# EAGLE design C3D Re-Mini (EAGLE 7.5.0)
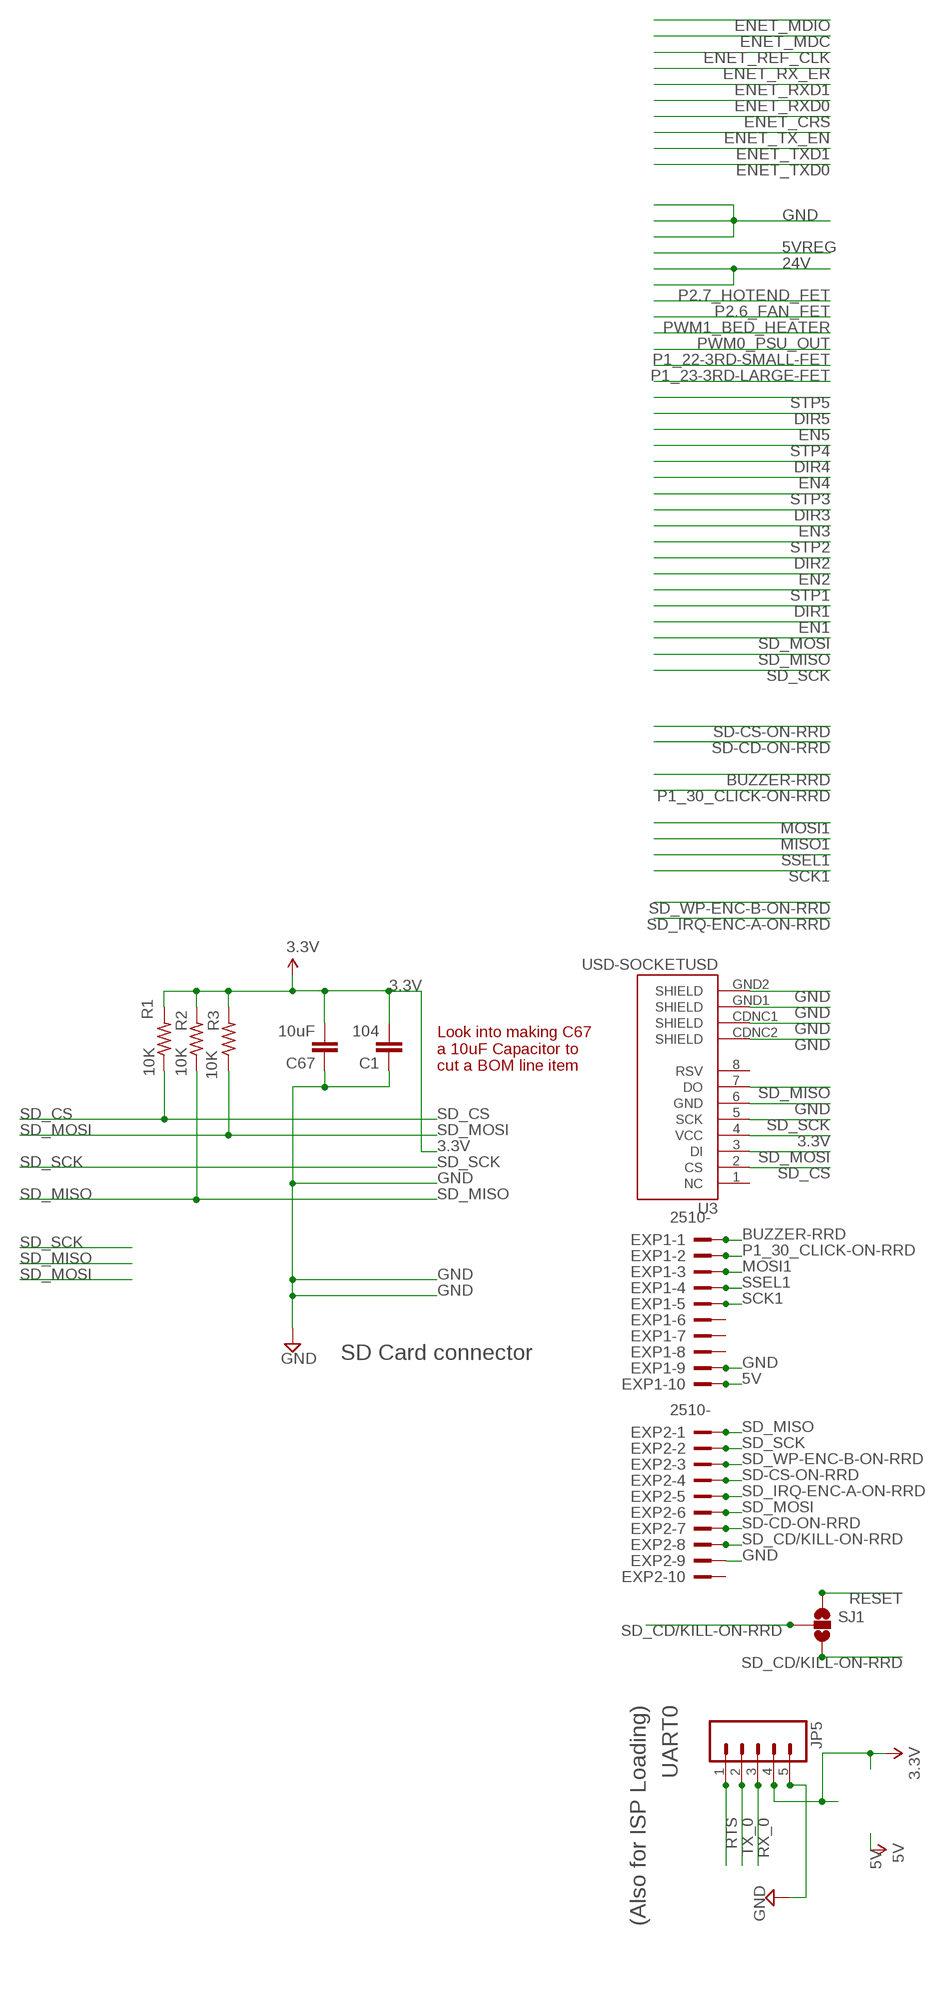
[diagram p0: schematic, sheet 1, part 1 of 3]
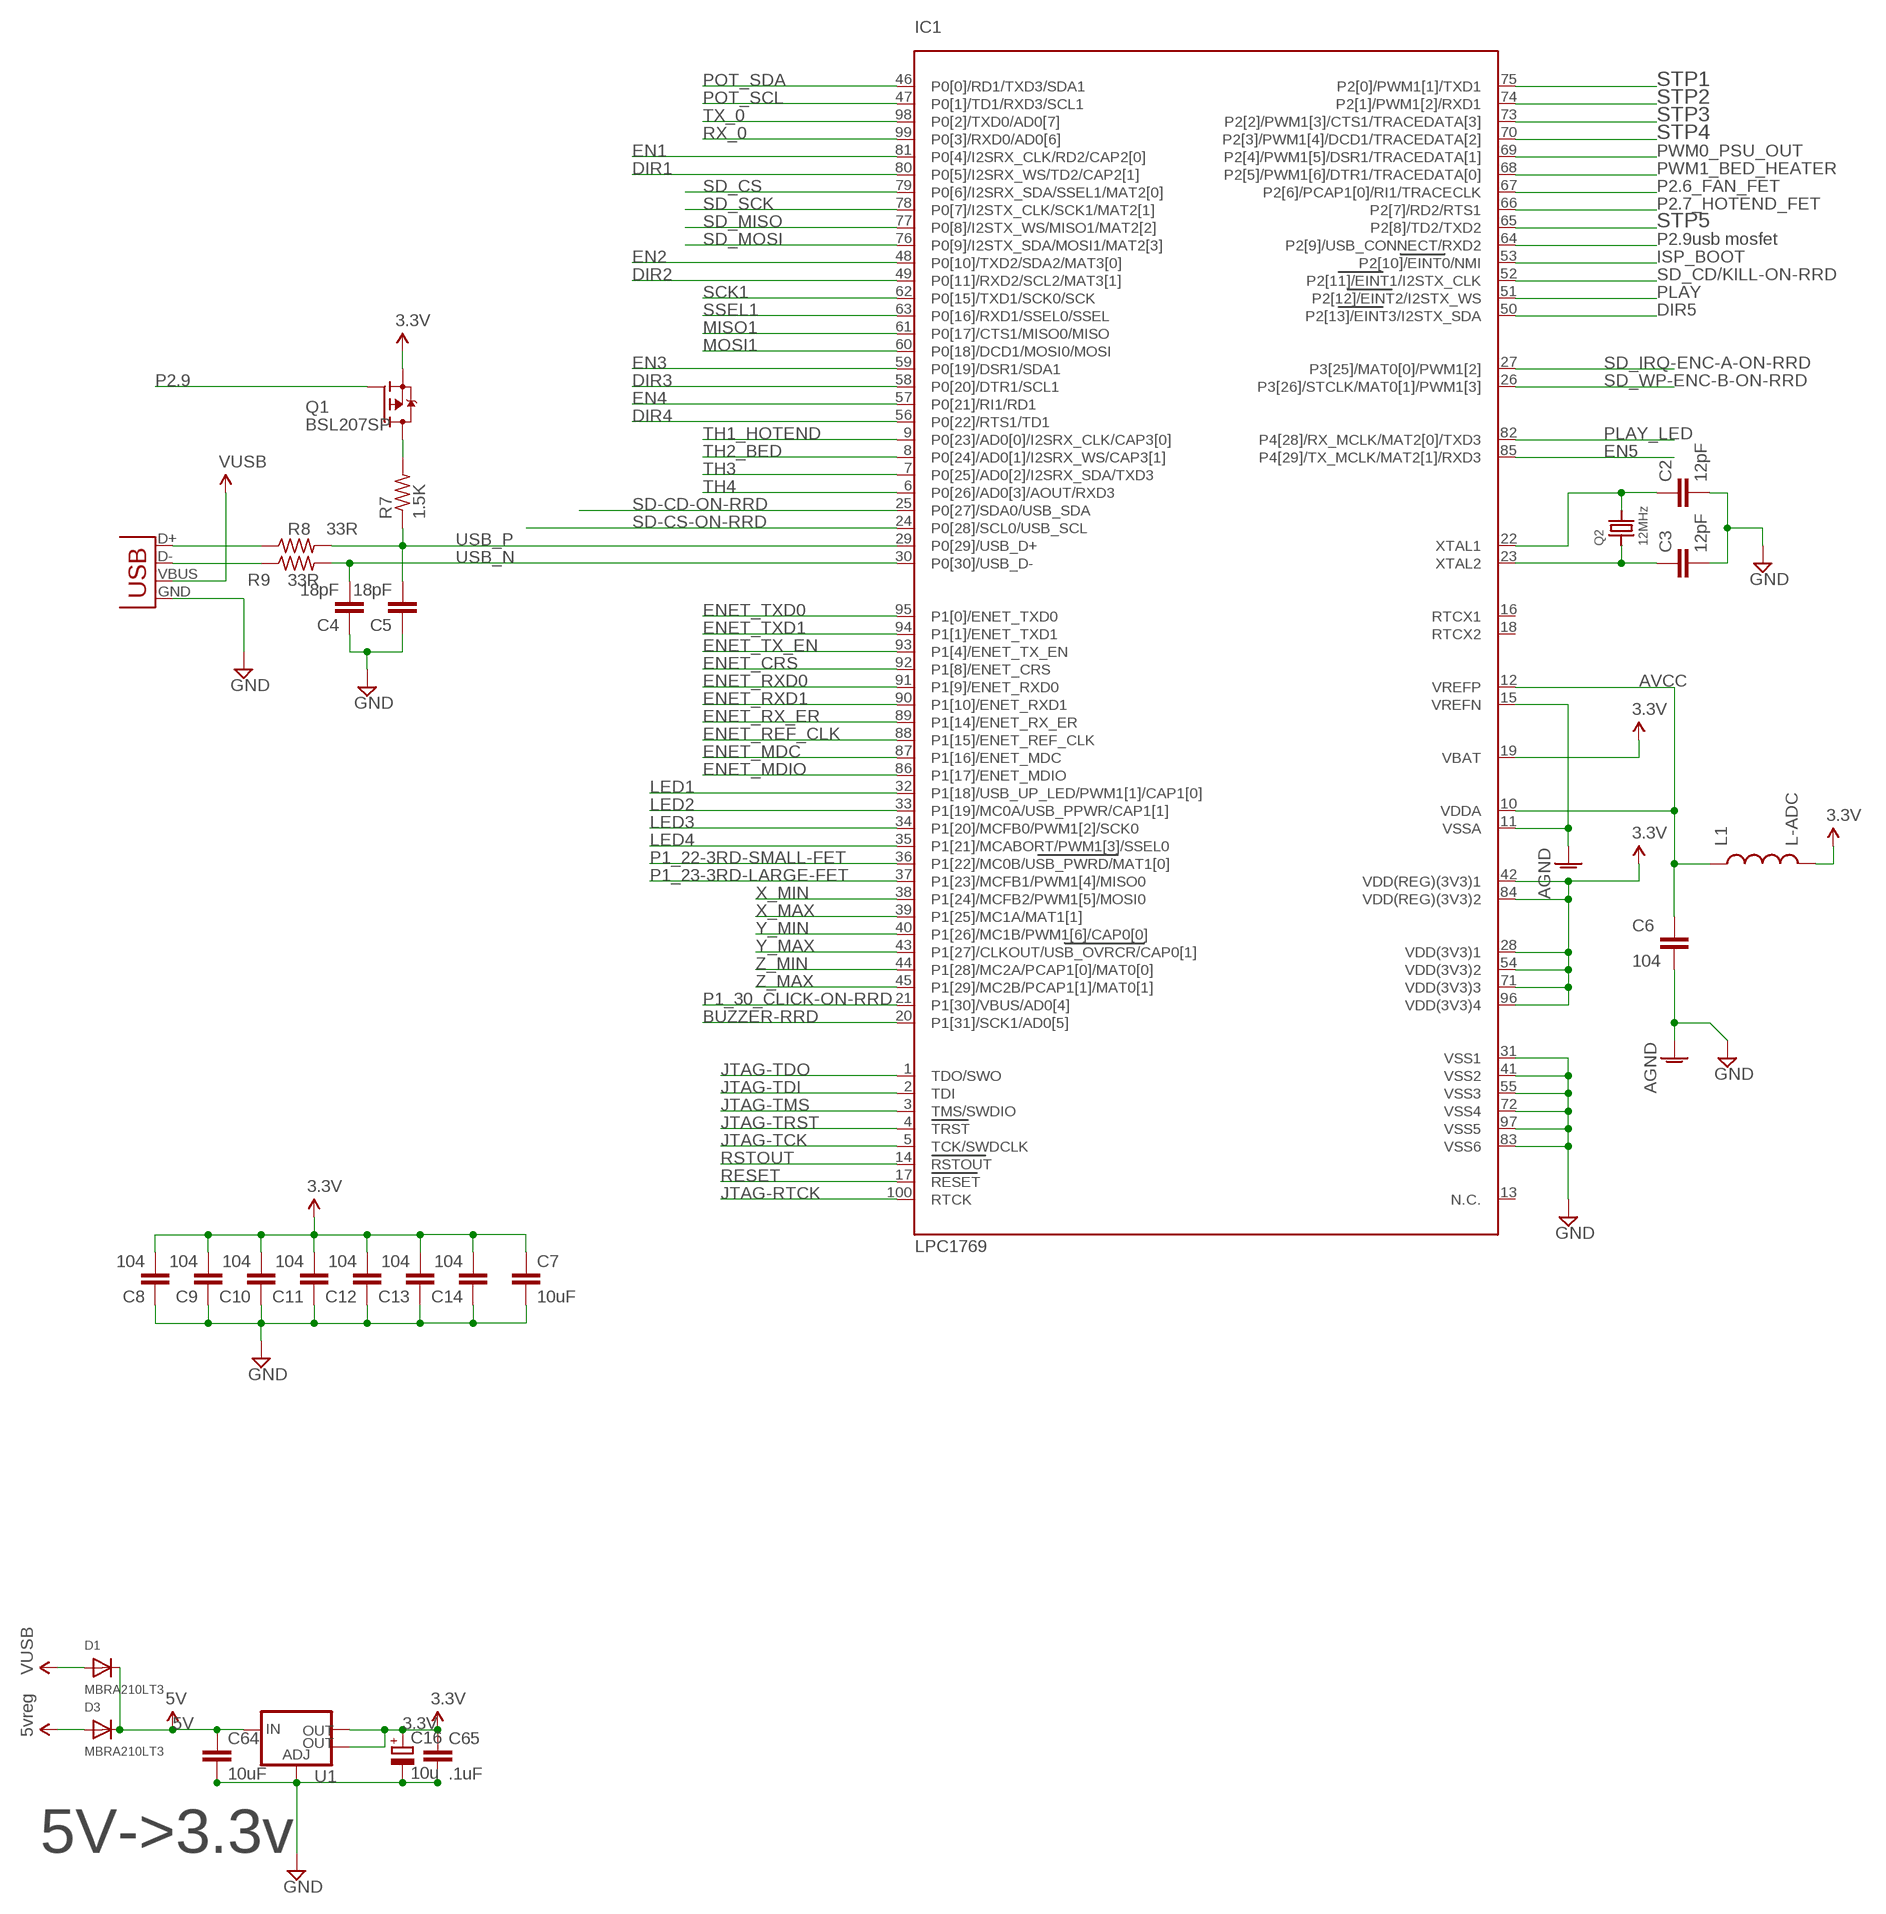
[diagram p1: schematic, sheet 1, part 2 of 3]
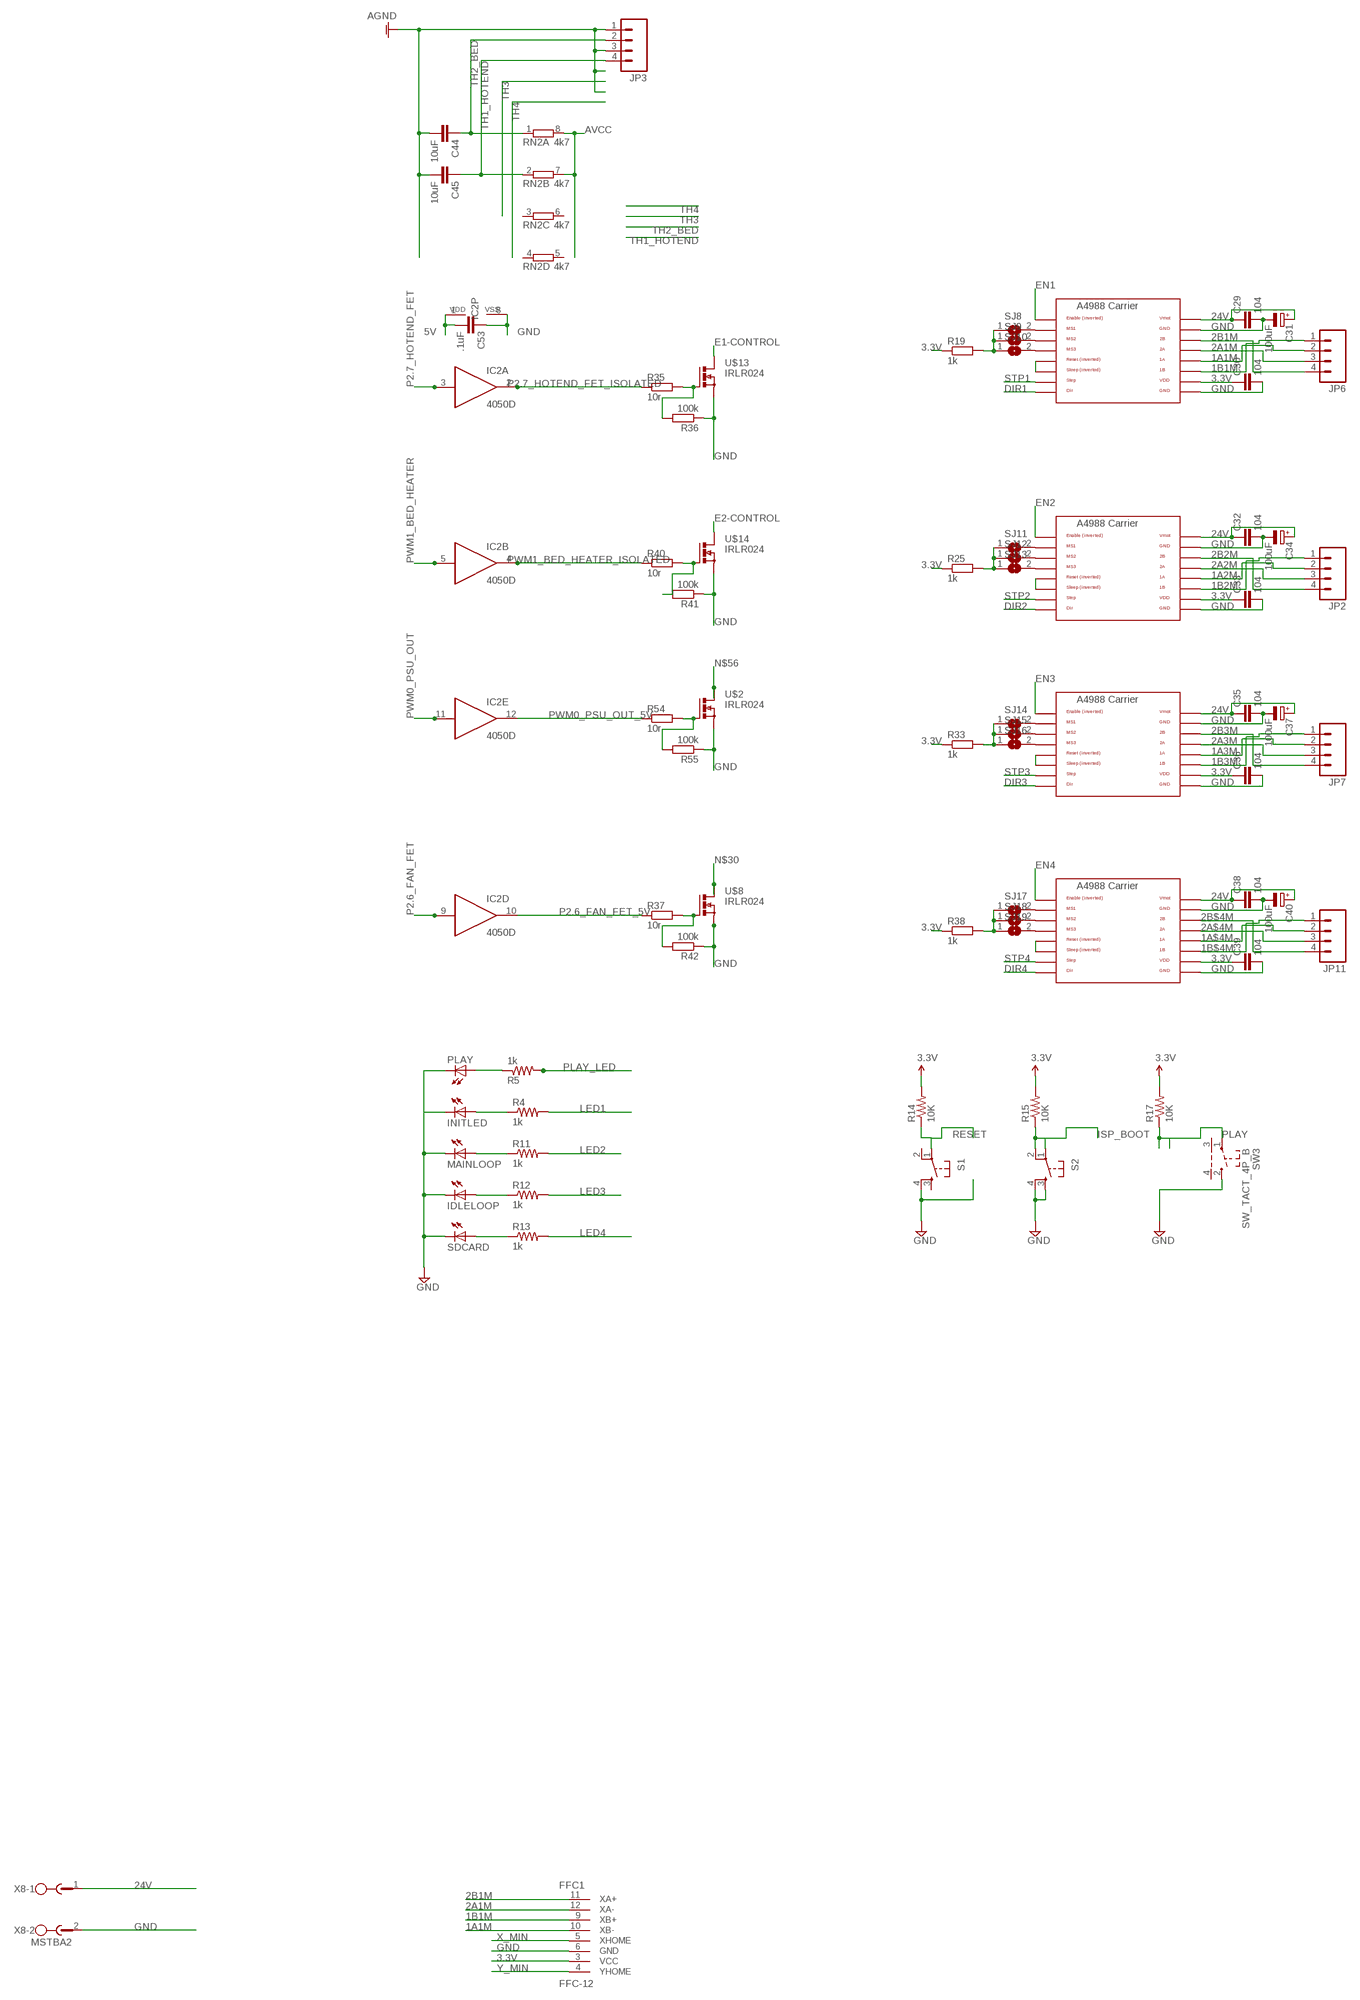
[diagram p2: schematic, sheet 1, part 3 of 3]

## Parts
C1  104  C-EUC0603  [C0603]
C2  12pF  C-EUC0603  [C0603]
C3  12pF  C-EUC0603  [C0603]
C4  18pF  C-EUC0603  [C0603]
C5  18pF  C-EUC0603  [C0603]
C6  104  C-EUC0603  [C0603]
C7  10uF  C-EUC0603  [C0603]
C8  104  C-EUC0603  [C0603]
C9  104  C-EUC0603  [C0603]
C10  104  C-EUC0603  [C0603]
C11  104  C-EUC0603  [C0603]
C12  104  C-EUC0603  [C0603]
C13  104  C-EUC0603  [C0603]
C14  104  C-EUC0603  [C0603]
C16  10u  CPOL-EUE2-4  [E2-4]
C29  104  C-EUC0603  [C0603]
C30  104  C-EUC0603  [C0603]
C31  100uF  CPOL-EU153CLV-0807  [153CLV-0807]
C32  104  C-EUC0603  [C0603]
C33  104  C-EUC0603  [C0603]
C34  100uF  CPOL-EU153CLV-0807  [153CLV-0807]
C35  104  C-EUC0603  [C0603]
C36  104  C-EUC0603  [C0603]
C37  100uF  CPOL-EU153CLV-0807  [153CLV-0807]
C38  104  C-EUC0603  [C0603]
C39  104  C-EUC0603  [C0603]
C40  100uF  CPOL-EU153CLV-0807  [153CLV-0807]
C44  10uF  C-EUC0603  [C0603]
C45  10uF  C-EUC0603  [C0603]
C53  .1uF  C-EUC0603  [C0603]
C64  10uF  C-EUC1206  [C1206]
C65  .1uF  C-EUC0603  [C0603]
C67  10uF  C-EUC0603  [C0603]
D1  MBRA210LT3  DIODESMA  [SMADIODE]
D3  MBRA210LT3  DIODESMA  [SMADIODE]
EXP1  2510-  [PAK100/2500-10]
EXP2  2510-  [PAK100/2500-10]
FFC1  FFC-12  FFC-12P-S-CON12P-S_CON  [FFC]
IC1  LPC1769  LPC1768  [LQFP100]
IC2  4050D  [SO16]
IDLELOOP  LEDCHIP-LED0805  [CHIP-LED0805]
INITLED  LEDCHIP-LED0805  [CHIP-LED0805]
JP2  M04POLAR_LOCK  [MOLEX-1X4_LOCK]
JP3  M04LOCK  [1X04_LOCK]
JP5  M05NO_SILK  [1X05_NO_SILK]
JP6  M04POLAR_LOCK  [MOLEX-1X4_LOCK]
JP7  M04POLAR_LOCK  [MOLEX-1X4_LOCK]
JP11  M04POLAR_LOCK  [MOLEX-1X4_LOCK]
L1  L-ADC  INDUCTOR0603  [0603]
MAINLOOP  LEDCHIP-LED0805  [CHIP-LED0805]
PLAY  LEDCHIP-LED0805  [CHIP-LED0805]
Q1  BSL207SP  [SC74_INFINEON]
Q2  12MHz  CRYSTALTHIN  [CRYSTAL_3.2X2.5]
R1  10K  R-US_R0603  [R0603]
R2  10K  R-US_R0603  [R0603]
R3  10K  R-US_R0603  [R0603]
R4  1k  R-US_R0603  [R0603]
R5  1k  R-US_R0603  [R0603]
R7  1.5K  R-US_R0603  [R0603]
R8  33R  R-US_R0603  [R0603]
R9  33R  R-US_R0603  [R0603]
R11  1k  R-US_R0603  [R0603]
R12  1k  R-US_R0603  [R0603]
R13  1k  R-US_R0603  [R0603]
R14  10K  R-US_R0603  [R0603]
R15  10K  R-US_R0603  [R0603]
R17  10K  R-US_R0603  [R0603]
R19  1k  R-EU_R0603  [R0603@1]
R25  1k  R-EU_R0603  [R0603@1]
R33  1k  R-EU_R0603  [R0603@1]
R35  10r  R-EU_R0603  [R0603@1]
R36  100k  R-EU_R0603  [R0603@1]
R37  10r  R-EU_R0603  [R0603@1]
R38  1k  R-EU_R0603  [R0603@1]
R40  10r  R-EU_R0603  [R0603@1]
R41  100k  R-EU_R0603  [R0603@1]
R42  100k  R-EU_R0603  [R0603@1]
R54  10r  R-EU_R0603  [R0603@1]
R55  100k  R-EU_R0603  [R0603@1]
RN2  4k7  4R-N0603-ARV  [0603-ARV]
S1  TAC_SWITCHSMD  [TACTILE_SWITCH_SMD]
S2  TAC_SWITCHSMD  [TACTILE_SWITCH_SMD]
SDCARD  LEDCHIP-LED0805  [CHIP-LED0805]
SJ1  SOLDERJUMPER_2WAYS  [SJ_3]
SJ8  SJ  [SJ]
SJ9  SJ  [SJ]
SJ10  SJ  [SJ]
SJ11  SJ  [SJ]
SJ12  SJ  [SJ]
SJ13  SJ  [SJ]
SJ14  SJ  [SJ]
SJ15  SJ  [SJ]
SJ16  SJ  [SJ]
SJ17  SJ  [SJ]
SJ18  SJ  [SJ]
SJ19  SJ  [SJ]
SW3  SW_TACT_4P_B  [SW_TACT_STANDARD_RIGHT_ANGLE]
U1  V_REG_LM1117SOT223  [SOT223]
U3  USD-SOCKETUSD  [USD-SOCKET-PP]
U$1  POLOLU_A4983CARRIER  [A4988BREAKOUT]
U$2  IRLR024  N-POWER-MOSFETDPAK-MOSFET  [D-PAK_TO252AA]
U$5  POLOLU_A4983CARRIER  [A4988BREAKOUT]
U$6  POLOLU_A4983CARRIER  [A4988BREAKOUT]
U$7  POLOLU_A4983CARRIER  [A4988BREAKOUT]
U$8  IRLR024  N-POWER-MOSFETDPAK-MOSFET  [D-PAK_TO252AA]
U$13  IRLR024  N-POWER-MOSFETDPAK-MOSFET  [D-PAK_TO252AA]
U$14  IRLR024  N-POWER-MOSFETDPAK-MOSFET  [D-PAK_TO252AA]
X8  MSTBA2  [MSTBA2]
X14  USBPTH  [USB-B-PTH]

## Nets
1A1M: FFC1.10(XB-) JP6.2 U$1.1A
1A2M: JP2.2 U$5.1A
1A3M: JP7.2 U$6.1A
1A$4M: JP11.2 U$7.1A
1B1M: FFC1.9(XB+) JP6.1 U$1.1B
1B2M: JP2.1 U$5.1B
1B3M: JP7.1 U$6.1B
1B$4M: JP11.1 U$7.1B
2A1M: FFC1.12(XA-) JP6.3 U$1.2A
2A2M: JP2.3 U$5.2A
2A3M: JP7.3 U$6.2A
2A$4M: JP11.3 U$7.2A
2B1M: FFC1.11(XA+) JP6.4 U$1.2B
2B2M: JP2.4 U$5.2B
2B3M: JP7.4 U$6.2B
2B$4M: JP11.4 U$7.2B
3.3V: C1.2 C7.1 C8.2 C9.2 C10.2 C11.2 C12.2 C13.2 C14.2 C16.+ C30.1 C33.1 C36.1 C39.1 C65.1 C67.2 FFC1.3(VCC) IC1.19(VBAT) IC1.28(VDD(3V3)1) IC1.42(VDD(REG)(3V3)1) IC1.54(VDD(3V3)2) IC1.71(VDD(3V3)3) IC1.84(VDD(REG)(3V3)2) IC1.96(VDD(3V3)4) JP5.4 L1.2 Q1.4(S) R1.2 R2.2 R3.2 R14.2 R15.2 R17.2 R19.1 R25.1 R33.1 R38.1 U1.2(OUT) U1.4(OUT) U3.4(VCC) U$1.VDD U$5.VDD U$6.VDD U$7.VDD
5V: C53.2 C64.1 D1.C D3.C EXP1.10 IC2.1(P:VDD) U1.3(IN)
5VREG: D3.A ; supply symbol labelled 5vreg
24V: C29.1 C31.+ C32.1 C34.+ C35.1 C37.+ C38.1 C40.+ U$1.VMOT U$5.VMOT U$6.VMOT U$7.VMOT X8.1
AGND: C6.2 C44.2 C45.2 IC1.11(VSSA) IC1.15(VREFN) JP3.1 JP3.3 ; supply symbol labelled GND
AVCC: C6.1 IC1.10(VDDA) IC1.12(VREFP) L1.1 RN2.7 RN2.8
BUZZER-RRD: EXP1.1 IC1.20(P1[31]/SCK1/AD0[5])
DIR1: IC1.80(P0[5]/I2SRX_WS/TD2/CAP2[1]) U$1.DIR
DIR2: IC1.49(P0[11]/RXD2/SCL2/MAT3[1]) U$5.DIR
DIR3: IC1.58(P0[20]/DTR1/SCL1) U$6.DIR
DIR4: IC1.56(P0[22]/RTS1/TD1) U$7.DIR
DIR5: IC1.50(P2[13]/EINT3/I2STX_SDA)
E1-CONTROL [3.3-Amp Class]: U$13.4(D)
E2-CONTROL [3.3-Amp Class]: U$14.4(D)
EN1: IC1.81(P0[4]/I2SRX_CLK/RD2/CAP2[0]) U$1.EN
EN2: IC1.48(P0[10]/TXD2/SDA2/MAT3[0]) U$5.EN
EN3: IC1.59(P0[19]/DSR1/SDA1) U$6.EN
EN4: IC1.57(P0[21]/RI1/RD1) U$7.EN
EN5: IC1.85(P4[29]/TX_MCLK/MAT2[1]/RXD3)
ENET_CRS: IC1.92(P1[8]/ENET_CRS)
ENET_MDC: IC1.87(P1[16]/ENET_MDC)
ENET_MDIO: IC1.86(P1[17]/ENET_MDIO)
ENET_REF_CLK: IC1.88(P1[15]/ENET_REF_CLK)
ENET_RX_ER: IC1.89(P1[14]/ENET_RX_ER)
ENET_RXD0: IC1.91(P1[9]/ENET_RXD0)
ENET_RXD1: IC1.90(P1[10]/ENET_RXD1)
ENET_TX_EN: IC1.93(P1[4]/ENET_TX_EN)
ENET_TXD0: IC1.95(P1[0]/ENET_TXD0)
ENET_TXD1: IC1.94(P1[1]/ENET_TXD1)
GND: C1.1 C2.2 C3.2 C4.1 C5.1 C7.2 C8.1 C9.1 C10.1 C11.1 C12.1 C13.1 C14.1 C16.- C29.2 C30.2 C31.- C32.2 C33.2 C34.- C35.2 C36.2 C37.- C38.2 C39.2 C40.- C53.1 C64.2 C65.2 C67.1 EXP1.9 EXP2.9 FFC1.6(GND) IC1.31(VSS1) IC1.41(VSS2) IC1.55(VSS3) IC1.72(VSS4) IC1.83(VSS6) IC1.97(VSS5) IC2.8(P:VSS) IDLELOOP.C INITLED.C JP5.5 MAINLOOP.C PLAY.C R36.1 R41.1 R42.1 R55.1 S1.4 S2.3 S2.4 SDCARD.C SW3.2 U1.1(ADJ) U3.6(GND) U3.CDNC1(SHIELD) U3.CDNC2(SHIELD) U3.GND1(SHIELD) U3.GND2(SHIELD) U$1.GND U$1.GND@0(GND) U$2.3(S) U$5.GND U$5.GND@0(GND) U$6.GND U$6.GND@0(GND) U$7.GND U$7.GND@0(GND) U$8.3(S) U$13.3(S) U$14.3(S) X8.2 X14.GND
ISP_BOOT: IC1.53(P2[10]/EINT0/NMI) R15.1 S2.1 S2.2
JTAG-RTCK: IC1.100(RTCK)
JTAG-TCK: IC1.5(TCK/SWDCLK)
JTAG-TDI: IC1.2(TDI)
JTAG-TDO: IC1.1(TDO/SWO)
JTAG-TMS: IC1.3(TMS/SWDIO)
JTAG-TRST: IC1.4(TRST)
LED1: IC1.32(P1[18]/USB_UP_LED/PWM1[1]/CAP1[0]) R4.2
LED2: IC1.33(P1[19]/MC0A/USB_PPWR/CAP1[1]) R11.2
LED3: IC1.34(P1[20]/MCFB0/PWM1[2]/SCK0) R12.2
LED4: IC1.35(P1[21]/MCABORT/PWM1[3]/SSEL0) R13.2
MISO1: IC1.61(P0[17]/CTS1/MISO0/MISO)
MOSI1: EXP1.3 IC1.60(P0[18]/DCD1/MOSI0/MOSI)
N$1: C2.1 IC1.22(XTAL1) Q2.2
N$2: C3.1 IC1.23(XTAL2) Q2.1
N$4: PLAY.A R5.1
N$6: SJ8.2 U$1.MS1
N$8: SJ9.2 U$1.MS2
N$10: SJ10.2 U$1.MS3
N$12: U$5.RST U$5.SLP(SLEEP)
N$14: R25.2 SJ11.1 SJ12.1 SJ13.1
N$15: SJ11.2 U$5.MS1
N$17: SJ12.2 U$5.MS2
N$19: SJ13.2 U$5.MS3
N$22: U$6.RST U$6.SLP(SLEEP)
N$23: R37.2 R42.2 U$8.1(G)
N$24: R33.2 SJ14.1 SJ15.1 SJ16.1
N$25: SJ14.2 U$6.MS1
N$26: SJ15.2 U$6.MS2
N$27: SJ16.2 U$6.MS3
N$28: R35.2 R36.2 U$13.1(G)
N$29: R19.2 SJ8.1 SJ9.1 SJ10.1
N$30: U$8.4(D)
N$31: U$7.RST U$7.SLP(SLEEP)
N$32: R38.2 SJ17.1 SJ18.1 SJ19.1
N$33: SJ17.2 U$7.MS1
N$34: SJ18.2 U$7.MS2
N$35: U$1.RST U$1.SLP(SLEEP)
N$36: SJ19.2 U$7.MS3
N$37: R40.2 R41.2 U$14.1(G)
N$51: Q1.1(D) Q1.2(D) Q1.5(D) Q1.6(D) R7.2
N$55: R54.2 R55.2 U$2.1(G)
N$56: U$2.4(D)
N$61: R8.1 X14.D+
N$62: R9.1 X14.D-
N$84: R13.1 SDCARD.A
N$85: IDLELOOP.A R12.1
N$86: MAINLOOP.A R11.1
N$87: INITLED.A R4.1
P1_22-3RD-SMALL-FET: IC1.36(P1[22]/MC0B/USB_PWRD/MAT1[0])
P1_23-3RD-LARGE-FET: IC1.37(P1[23]/MCFB1/PWM1[4]/MISO0)
P1_30_CLICK-ON-RRD: EXP1.2 IC1.21(P1[30]/VBUS/AD0[4])
P2.6_FAN_FET: IC1.67(P2[6]/PCAP1[0]/RI1/TRACECLK) IC2.9(D:I)
P2.6_FAN_FET_5V: IC2.10(D:O) R37.1
P2.7_HOTEND_FET: IC1.66(P2[7]/RD2/RTS1) IC2.3(A:I)
P2.7_HOTEND_FET_ISOLATED: IC2.2(A:O) R35.1
P2.9: IC1.64(P2[9]/USB_CONNECT/RXD2) Q1.3(G)
PLAY: IC1.51(P2[12]/EINT2/I2STX_WS) R17.1 SW3.1
PLAY_LED: IC1.82(P4[28]/RX_MCLK/MAT2[0]/TXD3) R5.2
POT_SCL: IC1.47(P0[1]/TD1/RXD3/SCL1)
POT_SDA: IC1.46(P0[0]/RD1/TXD3/SDA1)
PWM0_PSU_OUT: IC1.69(P2[4]/PWM1[5]/DSR1/TRACEDATA[1]) IC2.11(E:I)
PWM0_PSU_OUT_5V: IC2.12(E:O) R54.1
PWM1_BED_HEATER: IC1.68(P2[5]/PWM1[6]/DTR1/TRACEDATA[0]) IC2.5(B:I)
PWM1_BED_HEATER_ISOLATED: IC2.4(B:O) R40.1
RESET: IC1.17(RESET) R14.1 S1.1 SJ1.1
RSTOUT: IC1.14(RSTOUT)
RTS: JP5.1
RX_0: IC1.99(P0[3]/RXD0/AD0[6]) JP5.3
SCK1: EXP1.5 IC1.62(P0[15]/TXD1/SCK0/SCK)
SD-CD-ON-RRD: EXP2.7 IC1.25(P0[27]/SDA0/USB_SDA)
SD-CS-ON-RRD: EXP2.4 IC1.24(P0[28]/SCL0/USB_SCL)
SD_CD/KILL-ON-RRD: EXP2.8 IC1.52(P2[11]/EINT1/I2STX_CLK) SJ1.2 SJ1.3
SD_CS: IC1.79(P0[6]/I2SRX_SDA/SSEL1/MAT2[0]) R1.1 U3.2(CS)
SD_IRQ-ENC-A-ON-RRD: EXP2.5 IC1.27(P3[25]/MAT0[0]/PWM1[2])
SD_MISO: EXP2.1 IC1.77(P0[8]/I2STX_WS/MISO1/MAT2[2]) R2.1 U3.7(DO)
SD_MOSI: EXP2.6 IC1.76(P0[9]/I2STX_SDA/MOSI1/MAT2[3]) R3.1 U3.3(DI)
SD_SCK: EXP2.2 IC1.78(P0[7]/I2STX_CLK/SCK1/MAT2[1]) U3.5(SCK)
SD_WP-ENC-B-ON-RRD: EXP2.3 IC1.26(P3[26]/STCLK/MAT0[1]/PWM1[3])
SSEL1: EXP1.4 IC1.63(P0[16]/RXD1/SSEL0/SSEL)
STP1: IC1.75(P2[0]/PWM1[1]/TXD1) U$1.STEP
STP2: IC1.74(P2[1]/PWM1[2]/RXD1) U$5.STEP
STP3: IC1.73(P2[2]/PWM1[3]/CTS1/TRACEDATA[3]) U$6.STEP
STP4: IC1.70(P2[3]/PWM1[4]/DCD1/TRACEDATA[2]) U$7.STEP
STP5: IC1.65(P2[8]/TD2/TXD2)
TH1_HOTEND: C45.1 IC1.9(P0[23]/AD0[0]/I2SRX_CLK/CAP3[0]) JP3.4 RN2.2
TH2_BED: C44.1 IC1.8(P0[24]/AD0[1]/I2SRX_WS/CAP3[1]) JP3.2 RN2.1
TH3: IC1.7(P0[25]/AD0[2]/I2SRX_SDA/TXD3)
TH4: IC1.6(P0[26]/AD0[3]/AOUT/RXD3)
TX_0: IC1.98(P0[2]/TXD0/AD0[7]) JP5.2
USB_N: C4.2 IC1.30(P0[30]/USB_D-) R9.2
USB_P: C5.2 IC1.29(P0[29]/USB_D+) R7.1 R8.2
VUSB: D1.A X14.VBUS
X_MAX: IC1.39(P1[25]/MC1A/MAT1[1])
X_MIN: FFC1.5(XHOME) IC1.38(P1[24]/MCFB2/PWM1[5]/MOSI0)
Y_MAX: IC1.43(P1[27]/CLKOUT/USB_OVRCR/CAP0[1])
Y_MIN: FFC1.4(YHOME) IC1.40(P1[26]/MC1B/PWM1[6]/CAP0[0])
Z_MAX: IC1.45(P1[29]/MC2B/PCAP1[1]/MAT0[1])
Z_MIN: IC1.44(P1[28]/MC2A/PCAP1[0]/MAT0[0])
Unconnected: EXP1.6 EXP1.7 EXP1.8 EXP2.10 IC1.13(N.C.) IC1.16(RTCX1) IC1.18(RTCX2) IC2.6(C:O) IC2.7(C:I) IC2.14(F:I) IC2.15(F:O) RN2.3 RN2.4 RN2.5 RN2.6 S1.2 S1.3 SW3.3 SW3.4 U3.1(NC) U3.8(RSV)

## Notes on the sheet
- Look into making C67 
  a 10uF Capacitor to 
  cut a BOM line item
- SD Card connector
- (Also for ISP Loading) | UART0
- usb mosfet
- 5V->3.3v

## Library data of the parts
C1 C7 C29 C30 C32 C33 C35 C36 C38 C39 C44 C45 C64 C65 C67 = resistor:C-EU: CAPACITOR, European symbol
C2-C6 C8-C14 C53 = rcl:C-EU: CAPACITOR, European symbol
C16 = rcl:CPOL-EU: POLARIZED CAPACITOR, European symbol
C31 C34 C37 C40 = resistor:CPOL-EU: POLARIZED CAPACITOR, European symbol
D1 D3 = microbuilder:DIODE: Diode SMADIODE - SMA Surface Mount Package 20V 1A Schottky Diode Digikey (500mV @ 1A, 500uA Vr @ 20V): 641-1014-6-ND 10V 2A Schottky Diode Digikey (350mV @ 2A, 700uA Vr @ 10V): MBRA210LT3 SOD-123 30V 200mA (800mV Vf, 2uA Vr @ 25V) Schottky Diode (very fast switching for boost, etc.) - Digikey: BAT54T1GOSTR-ND 30V 500mA (430mV Vf, 130uA Vr @ 30V) Schottky Diode - Digikey: B0530W-FDICT-ND MBR120 1A 20V (0.34Vf) Schottky Diode - Digikey: MBR120VLSFT1GOSCT-ND SOD-323 10V 570mA (380mV Vf, 3ns) Schottky Diode - Digikey: ZLLS410CT-ND 1N4148WS - 75V 150mA (1V Vf @ 10mA, 4ns) Simple Diode - Digikey: 1N4148WSFSCT-ND, Mouser: 512-1N4148WS SOD-523 BAT54 30V 200mA Schottky (0.8 Vf @ 100mA, 5ns) - Digikey: BAT54XV2CT-ND 30V 30mA Schottky Diode (RB751S-40TE61) - Digikey: RB751S-40TE61CT-ND SOT23-R/W - SOT23 Package (R = Solder Paste/Reflow Ovens, W = Hand-Soldering) BAT54Film 40V 300mA - Digikey: 497-7162-1-ND DO-1N4148 Through Hole Small Current Diode (any model)
EXP1 EXP2 = con-3m:2510-: 3M (TM) Pak 100 4-Wall Header Source: 3M; MF: 3M; MPN: 2510-6002UB; OC_FARNELL: 9838244; OC_NEWARK: 46F4725
FFC1 = WeisTek:FFC-12P-S-CON
IC1 = microbuilder:LPC1768: LPC1768 100 MHz 32-bit ARM Cortex-M3 based microcontroller featuring a high level of integration and low power consumption. 512 kB Flash, 64 kB SRAM, USB Device/Host/OTG, Ethernet, CAN, I2S, 10-bit DAC Digikey: 568-4796-ND
IC2 = 40xx:4050: Hex non-inverting BUFFER
IDLELOOP INITLED MAINLOOP PLAY SDCARD = led:LED: LED OSRAM: - CHIPLED LG R971, LG N971, LY N971, LG Q971, LY Q971, LO R971, LY R971 LH N974, LH R974 LS Q976, LO Q976, LY Q976 LO Q996 - Hyper CHIPLED LW Q18S LB Q993, LB Q99A, LB R99A - SideLED LS A670, LO A670, LY A670, LG A670, LP A670 LB A673, LV A673, LT A673, LW A673 LH A674 LY A675 LS A676, LA A676, LO A676, LY A676, LW A676 LS A679, LY A679, LG A679 - Hyper Micro SIDELED® LS Y876, LA Y876, LO Y876, LY Y876 LT Y87S - SmartLED LW L88C, LW L88S LB L89C, LB L89S, LG L890 LS L89K, LO L89K, LY L89K LS L896, LA L896, LO L896, LY L896 - TOPLED LS T670, LO T670, LY T670, LG T670, LP T670 LSG T670, LSP T670, LSY T670, LOP T670, LYG T670 LG T671, LOG T671, LSG T671 LB T673, LV T673, LT T673, LW T673 LH T674 LS T676, LA T676, LO T676, LY T676, LB T676, LH T676, LSB T676, LW T676 LB T67C, LV T67C, LT T67C, LS T67K, LO T67K, LY T67K, LW E67C LS E67B, LA E67B, LO E67B, LY E67B, LB E67C, LV E67C, LT E67C LW T67C LS T679, LY T679, LG T679 LS T770, LO T770, LY T770, LG T770, LP T770 LB T773, LV T773, LT T773, LW T773 LH T774 LS E675, LA E675, LY E675, LS T675 LS T776, LA T776, LO T776, LY T776, LB T776 LHGB T686 LT T68C, LB T68C - Hyper Mini TOPLED® LB M676 - Mini TOPLED Santana® LG M470 LS M47K, LO M47K, LY M47K Source: http://www.osram.convergy.de LUXEON: - LUMILED® LXK2-PW12-R00, LXK2-PW12-S00, LXK2-PW14-U00, LXK2-PW14-V00 LXK2-PM12-R00, LXK2-PM12-S00, LXK2-PM14-U00 LXK2-PE12-Q00, LXK2-PE12-R00, LXK2-PE12-S00, LXK2-PE14-T00, LXK2-PE14-U00 LXK2-PB12-K00, LXK2-PB12-L00, LXK2-PB12-M00, LXK2-PB14-N00, LXK2-PB14-P00, LXK2-PB14-Q00 LXK2-PR12-L00, LXK2-PR12-M00, LXK2-PR14-Q00, LXK2-PR14-R00 LXK2-PD12-Q00, LXK2-PD12-R00, LXK2-PD12-S00 LXK2-PH12-R00, LXK2-PH12-S00 LXK2-PL12-P00, LXK2-PL12-Q00, LXK2-PL12-R00 Source: www.luxeon.com KINGBRIGHT: KA-3528ASYC Source: www.kingbright.com
JP2 JP3 JP6 JP7 JP11 = SparkFun-Connectors:M04: Header 4 Standard 4-pin 0.1" header. Use with straight break away headers (SKU : PRT-00116), right angle break away headers (PRT-00553), swiss pins (PRT-00743), machine pins (PRT-00117), and female headers (PRT-00115). Molex polarized connector foot print use with SKU : PRT-08231 with associated crimp pins and housings. 1MM SMD Version SKU: PRT-10208
JP5 = SparkFun-Connectors:M05: Header 5 Standard 5-pin 0.1" header. Use with straight break away headers (SKU : PRT-00116), right angle break away headers (PRT-00553), swiss pins (PRT-00743), machine pins (PRT-00117), and female headers (PRT-00115). Molex polarized connector foot print use with SKU : PRT-08230 with associated crimp pins and housings.
L1 = SparkFun:INDUCTOR: Inductors Basic Inductor/Choke - 0603 and 1206. Footprints are not proven and vary greatly between part numbers.
Q1 = transistor-fet:BSL207SP: OptiMOS(R)-P Small-Signal-Transistor P-Channel, Enhancement mode, Super Logic Level (2.5 V rated) Source: http://www.infineon.com/upload/Document/BSL207SP_Rev2.01.pdf
Q2 = microbuilder:CRYSTAL: Crystals HC49UP - Surface Mount Crystal 4.0MHz 18pF +/-30ppm Surface Mount Crystal [Digikey: 535-9857-1-ND] 12.0 MHz Surface Mount Crystal [Digikey: 535-9869-6-ND] 25.0 MHz Surface Mount Crystal [Digikey: 535-9078-1-ND] 3.2 x 2.5mm - MEMs SMT Crystal 12.0 MHz 8pF 15ppm 3.2 x 2.5mm Crystal [Digikey: -10-70°C: 644-1047-1-ND -40-125°C: 644-1128-1-ND] 16.0 MHz 8pF 15ppm 3.2 x 2.5mm Crystal [Digikey: -10-70°C: 644-1049-1-ND -40-125°C: 644-1129-2-ND] 16.0 MHz 10pF 10ppm 3.2 x 2.5mm Crystal [Digikey: 644-1100-1-ND] 27.12 MHz 18pF 30ppm 3.2 x 2.5mm Crystal [Digikey: 887-1424-1-ND] 27.12MHz 10pF 10ppm 3.2 x 2.5mm Crystal [Digikey: 887-1329-1-ND] 4.9 x 1.8mm - MEMs SMT Crystal 32.768 KHz 12.5pF 20ppm 4.9 x 1.8mm Crystal [Digikey: SE2415CT-ND] Cylinder 32.768KHz Cylinder Crystal
R1-R5 R7-R9 R11-R15 R17 = resistor:R-US_: RESISTOR, American symbol
R19 R25 R33 R35-R38 R40-R42 R54 R55 = resistor:R-EU_: RESISTOR, European symbol
RN2 = resistor-dil:4R-N: Array Chip Resistor Source: RS Component / Phycomp; OC_FARNELL: unknown; OC_NEWARK: unknown
S1 S2 = SparkFun:TAC_SWITCH: Momentary Switch Button commonly used for reset or general input. Spark Fun Electronics SKU : COM-00097
SJ1 = SparkFun:SOLDERJUMPER_2WAY: Solder Jumper 2 way solder jumper
SJ8-SJ19 = jumper:SJ: SMD solder JUMPER
SW3 = dp_devices:SW_TACT_4P_B
U1 = SparkFun-PowerIC:V_REG_LM1117: Voltage Regulator LM1117 Standard adjustable voltage regulator but in SMD form. Spark Fun Electronics SKU : COM-00595; PROD_ID: VREG-08170
U3 = SparkFun-Connectors_PETERMICROSDEBAY:USD-SOCKET: microSD Socket Push-push type uSD socket. Schematic element and footprint production proven. Spark Fun Electronics SKU : PRT-00127. tDoc lines correctly indicate media card edge positions when inserting (unlocked, locked, depressed).
U$1 U$5-U$7 = RepRapjr:POLOLU_A4983CARRIER
U$2 U$8 U$13 U$14 = Cohesion_parts:N-POWER-MOSFET
X8 = con-phoenix-508:MSTBA2: PHOENIX; MF: FARNELL; MPN: 1757242; OC_FARNELL: 3705171; OC_NEWARK: 71C4161
X14 = SparkFun:USB: USB Connectors USB-B-PTH is fully proven SKU : PRT-00139 USB-miniB is fully proven SKU : PRT-00587 USB-A-PCB is untested. USB-A-H is throughly reviewed, but untested. Spark Fun Electronics SKU : PRT-00437 USB-B-SMT is throughly reviewed, but untested. Needs silkscreen touching up. USB-A-S has not been used/tested USB-MB-H has not been used/tested

## Net classes
1 power: width 0.6 mm, clearance 0.305 mm
2 ground: width 0.254 mm
4 30-Amp Class: width 2.54 mm
5 3.3-Amp Class: width 1.27 mm

## Board
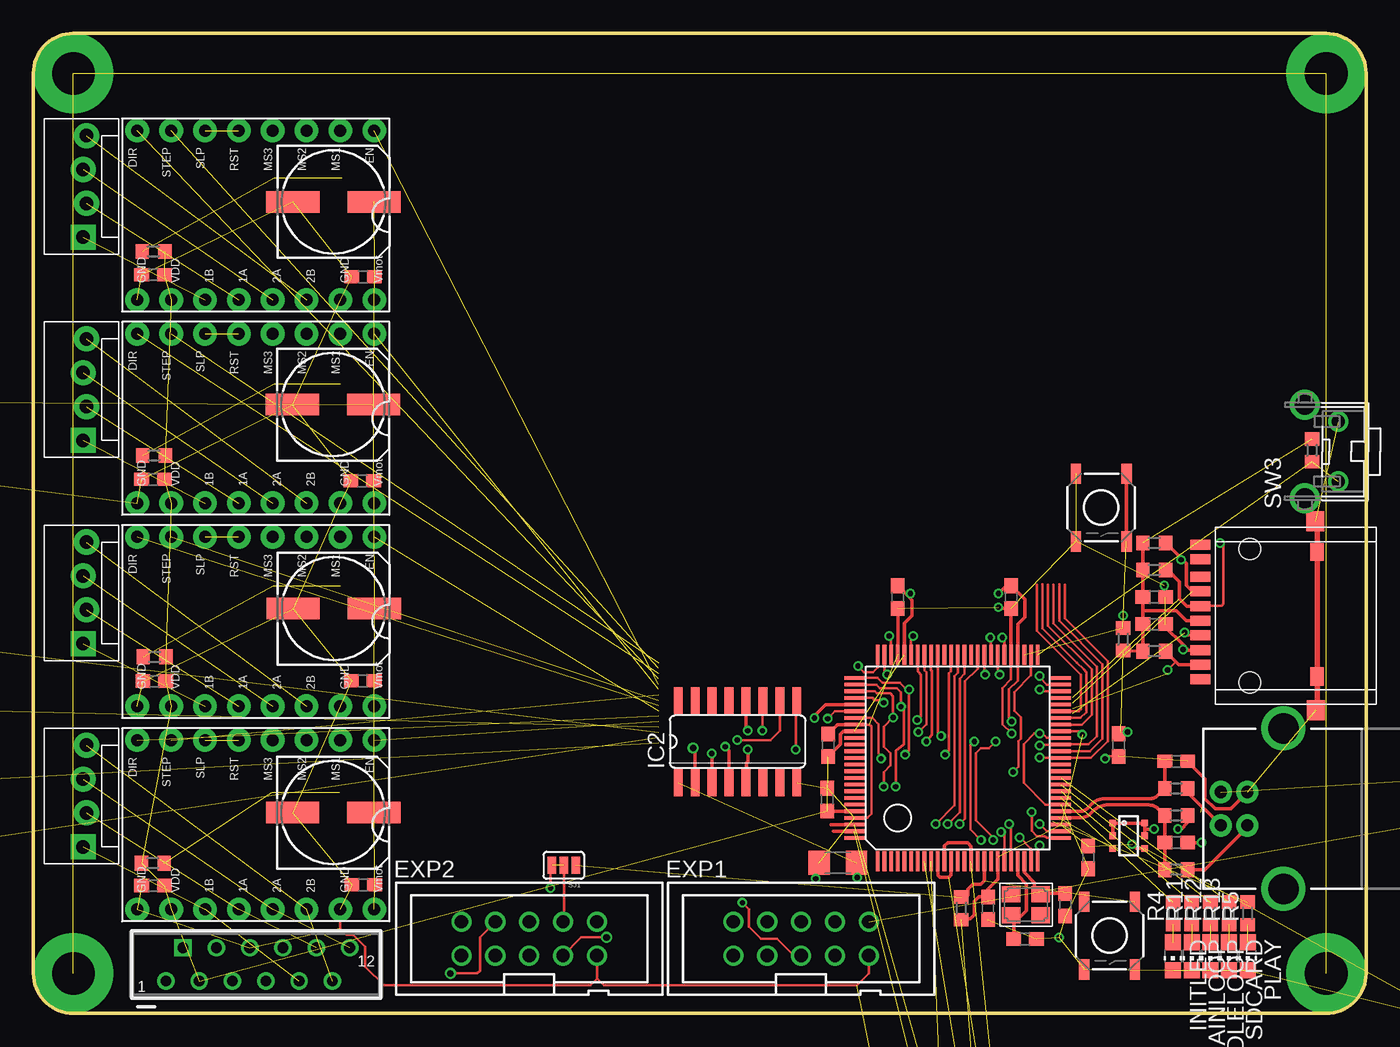
[diagram p3: board, top side]
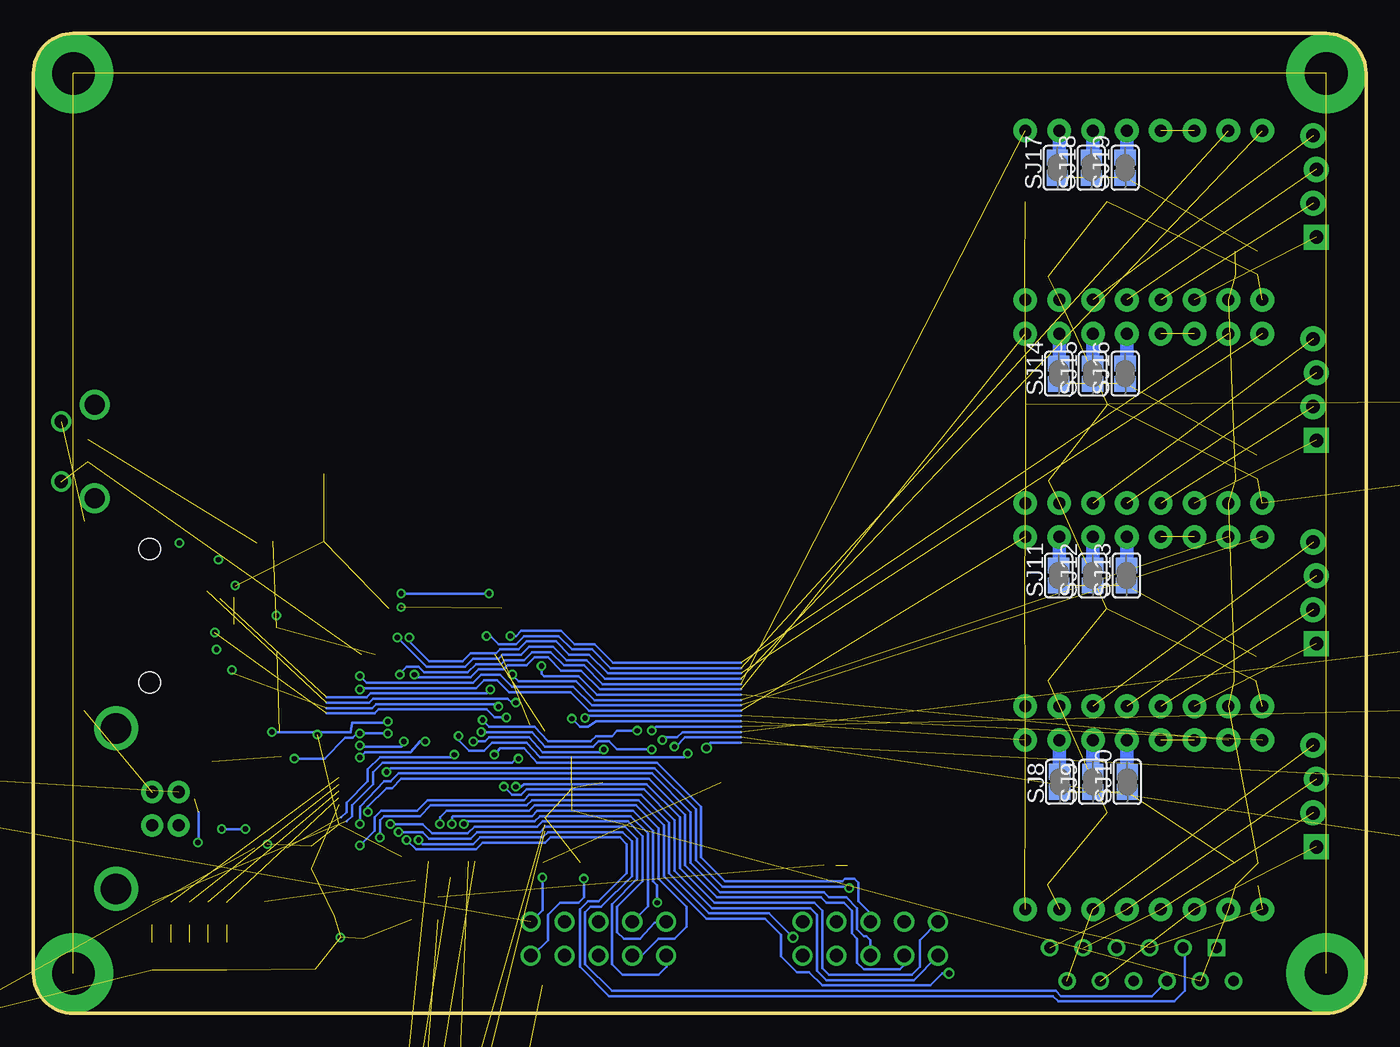
[diagram p4: board, bottom side, seen from below]

Size 100 x 73.5 mm. Coordinates in mm from the lower left corner, seen from the top.
Outline: 3,0 97,0 arc90 100,3 100,70.5 arc90 97,73.5 3,73.5 arc90 0,70.5 0,3 arc90 3,0
Copper layers (1*16): Top 0.035mm / dielectric 1.5mm / Bottom 0.035mm
Design rules "dirt_cheap_dirty_boards.v1": minimum track width 5mil, minimum drill 12mil, track to track 5mil, track to pad 5mil, pad to pad 5mil, via to via 5mil, smd to smd 0mil, copper to edge 10mil, drill to drill 10mil, minimum pad ring 10mil, minimum via ring 6mil, stop-mask expansion 2mil, vias tented up to drill 25mil, thermal gap 10mil

### Footprints (pad centres in the part's own frame; a part is rotated, then mirrored left to right if it is on the bottom)
C0603 = smd 1.1 x 1: 1 -0.85,0; 2 0.85,0
E2-4 = drill 0.813 pad 1.27: + -1.016,0 | drill 0.813 pad 1.27 octagon: - 1.016,0
153CLV-0807 = smd 4 x 1.6: + 3.05,0; - -3.05,0
C1206 = smd 1.6 x 1.8: 1 -1.4,0; 2 1.4,0
SMADIODE = smd 2.54 x 2.54: A 2.349,0; C -2.349,0
PAK100/2500-10 = drill 1 pad 1.422: 1 -5.08,-1.27; 2 -5.08,1.27; 3 -2.54,-1.27; 4 -2.54,1.27; 5 0,-1.27; 6 0,1.27; 7 2.54,-1.27; 8 2.54,1.27; 9 5.08,-1.27; 10 5.08,1.27
FFC = drill 0.8: 1 6.77,1.25; 3 4.27,1.25; 4 2.98,-1.25; 5 1.77,1.25; 6 0.48,-1.25; 7 -0.73,1.25; 8 -2.02,-1.25; 9 -3.23,1.25; 10 -4.52,-1.25; 11 -5.73,1.25; 12 -7.02,-1.25 | drill 0.8 square: 2 5.48,-1.25
LQFP100 = smd 0.27 x 1.5: 1 -6,-7.75; 2 -5.5,-7.75; 3 -5,-7.75; 4 -4.5,-7.75; 5 -4,-7.75; 6 -3.5,-7.75; 7 -3,-7.75; 8 -2.5,-7.75; 9 -2,-7.75; 10 -1.5,-7.75; 11 -1,-7.75; 12 -0.5,-7.75; 13 0,-7.75; 14 0.5,-7.75; 15 1,-7.75; 16 1.5,-7.75; 17 2,-7.75; 18 2.5,-7.75; 19 3,-7.75; 20 3.5,-7.75; 21 4,-7.75; 22 4.5,-7.75; 23 5,-7.75; 24 5.5,-7.75; 25 6,-7.75; 51 6,7.75; 52 5.5,7.75; 53 5,7.75; 54 4.5,7.75; 55 4,7.75; 56 3.5,7.75; 57 3,7.75; 58 2.5,7.75; 59 2,7.75; 60 1.5,7.75; 61 1,7.75; 62 0.5,7.75; 63 0,7.75; 64 -0.5,7.75; 65 -1,7.75; 66 -1.5,7.75; 67 -2,7.75; 68 -2.5,7.75; 69 -3,7.75; 70 -3.5,7.75; 71 -4,7.75; 72 -4.5,7.75; 73 -5,7.75; 74 -5.5,7.75; 75 -6,7.75 | smd 1.5 x 0.27: 26 7.75,-6; 27 7.75,-5.5; 28 7.75,-5; 29 7.75,-4.5; 30 7.75,-4; 31 7.75,-3.5; 32 7.75,-3; 33 7.75,-2.5; 34 7.75,-2; 35 7.75,-1.5; 36 7.75,-1; 37 7.75,-0.5; 38 7.75,0; 39 7.75,0.5; 40 7.75,1; 41 7.75,1.5; 42 7.75,2; 43 7.75,2.5; 44 7.75,3; 45 7.75,3.5; 46 7.75,4; 47 7.75,4.5; 48 7.75,5; 49 7.75,5.5; 50 7.75,6; 76 -7.75,6; 77 -7.75,5.5; 78 -7.75,5; 79 -7.75,4.5; 80 -7.75,4; 81 -7.75,3.5; 82 -7.75,3; 83 -7.75,2.5; 84 -7.75,2; 85 -7.75,1.5; 86 -7.75,1; 87 -7.75,0.5; 88 -7.75,0; 89 -7.75,-0.5; 90 -7.75,-1; 91 -7.75,-1.5; 92 -7.75,-2; 93 -7.75,-2.5; 94 -7.75,-3; 95 -7.75,-3.5; 96 -7.75,-4; 97 -7.75,-4.5; 98 -7.75,-5; 99 -7.75,-5.5; 100 -7.75,-6
SO16 = smd 0.66 x 2.032: 1 -4.445,-3.073; 2 -3.175,-3.073; 3 -1.905,-3.073; 4 -0.635,-3.073; 5 0.635,-3.073; 6 1.905,-3.073; 7 3.175,-3.073; 8 4.445,-3.073; 9 4.445,3.073; 10 3.175,3.073; 11 1.905,3.073; 12 0.635,3.073; 13 -0.635,3.073; 14 -1.905,3.073; 15 -3.175,3.073; 16 -4.445,3.073
CHIP-LED0805 = smd 1.2 x 1.2: A 0,-1.05; C 0,1.05
MOLEX-1X4_LOCK = drill 1.016 pad 1.88 square: 1 0,0.127 | drill 1.016 pad 1.88: 2 2.54,-0.127; 3 5.08,0.127; 4 7.62,-0.127
1X04_LOCK = drill 1.016 pad 1.88 square: 1 0,0.127 | drill 1.016 pad 1.88: 2 2.54,-0.127; 3 5.08,0.127; 4 7.62,-0.127
1X05_NO_SILK = drill 1.016 pad 1.88: 1 0,0; 2 2.54,0; 3 5.08,0; 4 7.62,0; 5 10.16,0
0603 = smd 1.1 x 1: 1 -0.85,0; 2 0.85,0
SC74_INFINEON = smd 0.5 x 0.5: 1 -0.95,-1.2; 2 0,-1.2; 3 0.95,-1.2; 4 0.95,1.2; 5 0,1.2; 6 -0.95,1.2
CRYSTAL_3.2X2.5 = smd 1.4 x 1.2: 1 -1.1,-0.8; 2 1.1,0.8; GND1 -1.1,0.8; GND2 1.1,-0.8
R0603 = smd 1 x 1.1: 1 -0.85,0; 2 0.85,0
R0603@1 = smd 1 x 1.1: 1 -0.85,0; 2 0.85,0
0603-ARV = smd 0.5 x 0.65: 1 -1.2,-0.625; 2 -0.4,-0.625; 3 0.4,-0.625; 4 1.2,-0.625; 5 1.2,0.625; 6 0.4,0.625; 7 -0.4,0.625; 8 -1.2,0.625
TACTILE_SWITCH_SMD = smd 1.524 x 0.762: 1 -2.54,1.905; 2 2.54,1.905; 3 -2.54,-1.905; 4 2.54,-1.905
SJ_3 = smd 0.635 x 1.27: 1 -0.889,0; 2 0,0; 3 0.889,0
SJ = smd 1.168 x 1.6: 1 -0.762,0; 2 0.762,0
SW_TACT_STANDARD_RIGHT_ANGLE = drill 1: 1 -2.25,0; 2 2.25,0 | drill 1.5: 3 -3.5,2.5; 4 3.5,2.5
SOT223 = smd 1.219 x 2.235: 1 -2.311,-3.099; 2 0,-3.099; 3 2.311,-3.099 | smd 3.6 x 2.2: 4 0,3.099
USD-SOCKET-PP = smd 0.75 x 1.5: 1 2.925,1.125; 2 1.825,1.125; 3 0.725,1.125; 4 -0.375,1.125; 5 -1.475,1.125; 6 -2.575,1.125; 7 -3.675,1.125; 8 -4.775,1.125; CD1 5.325,1.125; CD2 4.225,1.125 | smd 1.4 x 1: CDNC1 -4.55,-7.65 | smd 1.3 x 1: CDNC2 4.775,-7.65 | smd 1.5 x 1.35: GND1 -7.075,-7.55; GND2 7.075,-7.5 | hole 1.6: -5,-2.6; 5,-2.6
A4988BREAKOUT = drill 0.9 pad 1.778: 1A 8.89,1.27; 1B 11.43,1.27; 2A 6.35,1.27; 2B 3.81,1.27; DIR 16.51,-11.43; EN -1.27,-11.43; GND 16.51,1.27; GND@0 1.27,1.27; MS1 1.27,-11.43; MS2 3.81,-11.43; MS3 6.35,-11.43; RST 8.89,-11.43; SLP 11.43,-11.43; STEP 13.97,-11.43; VDD 13.97,1.27; VMOT -1.27,1.27
D-PAK_TO252AA = smd 1 x 1.6: 1 -2.28,-4.8; 3 2.28,-4.8 | smd 5.4 x 6.2: 4 0,2.5
MSTBA2 = drill 1.397 long: 1 -2.54,5.08; 2 2.54,5.08
USB-B-PTH = drill 0.914 pad 1.676: D+ 0,1.25; D- 1.981,1.25; GND 0,-1.25; VBUS 1.981,-1.25 | drill 2.286: S1 -2.718,-6.02; S2 -2.718,6.02

### Placement (x,y rotation side)
C1  84.09,31.22 180 top
C2  74.4,5.58 0 top
C3  77.42,8.15 270 top
C4  85.74,18.9 180 top
C5  85.74,12.81 180 top
C6  72.42,-20.47 180 top  (outside the outline)
C7  109.19,-5.84 0 top  (outside the outline)
C8  64.85,31.22 90 top
C9  73.36,31.22 90 top
C10  81.42,20.12 90 top
C11  71.63,7.88 90 top
C12  59.57,16.03 270 top
C13  109.4,-4.35 180 top  (outside the outline)
C14  59.63,20.11 270 top
C16  109.54,-1.58 0 top  (outside the outline)
C29  24.76,9.64 180 top
C30  8.98,9.58 180 top
C31  22.5,15.06 0 top
C32  24.72,24.94 180 top
C33  9.08,24.92 180 top
C34  22.54,30.36 0 top
C35  24.68,39.94 180 top
C36  8.98,40.06 180 top
C37  22.48,45.66 0 top
C38  24.74,55.24 180 top
C39  8.98,55.4 180 top
C40  22.52,60.86 0 top
C44  72.37,-16.77 0 top  (outside the outline)
C45  72.43,-22.19 180 top  (outside the outline)
C53  134.9,21.78 270 top  (outside the outline)
C64  60.36,11.29 180 top
C65  79.15,11.7 270 top
C67  84.09,29.19 180 top
D1  140.75,19.87 0 top  (outside the outline)
D3  130.78,19.27 180 top  (outside the outline)
EXP1  57.6,5.6 0 top
EXP2  37.2,5.6 0 top
FFC1  16.71,3.67 180 top
IC1  69.36,19.16 0 top
IC2  52.84,20.39 0 top
IDLELOOP  88.3,4.3 180 top
INITLED  85.5,4.3 180 top
JP2  3.86,27.73 90 top
JP3  61.04,-19.95 0 top  (outside the outline)
JP5  83.01,-52.29 180 top  (outside the outline)
JP6  3.86,12.49 90 top
JP7  3.86,42.97 90 top
JP11  3.86,58.21 90 top
L1  72.42,-18.61 180 top  (outside the outline)
MAINLOOP  86.9,4.3 180 top
PLAY  91.1,4.3 180 top
Q1  82.19,13.31 270 top
Q2  74.47,8.15 180 top
R1  84.09,35.29 180 top
R2  84.09,27.16 180 top
R3  84.09,33.25 180 top
R4  85.5,7.5 90 top
R5  91.1,7.5 90 top
R7  85.74,14.84 0 top
R8  85.74,10.78 180 top
R9  85.74,16.87 180 top
R11  86.9,7.5 90 top
R12  88.3,7.5 90 top
R13  89.7,7.5 90 top
R14  69.62,7.87 270 top
R15  81.76,28.06 270 top
R17  95.93,42.22 90 top
R19  8.97,11.26 0 top
R25  9.09,26.74 180 top
R33  9.05,41.84 180 top
R35  -26.75,15.47 270 top  (outside the outline)
R36  -28.3,15.49 270 top  (outside the outline)
R37  -26.68,29.2 270 top  (outside the outline)
R38  9.01,57.14 180 top
R40  -26.65,8.85 270 top  (outside the outline)
R41  -28.32,8.79 270 top  (outside the outline)
R42  -28.29,29.2 270 top  (outside the outline)
R54  -26.66,22.4 270 top  (outside the outline)
R55  -28.3,22.4 270 top  (outside the outline)
RN2  72.5,-24.6 0 top  (outside the outline)
S1  80.74,5.83 270 top
S2  80.12,37.93 270 top
SDCARD  89.7,4.3 180 top
SJ1  39.8,11.1 180 top
SJ8  22.99,17.36 90 bottom
SJ9  20.51,17.36 90 bottom
SJ10  17.92,17.36 90 bottom
SJ11  23.06,32.84 90 bottom
SJ12  20.52,32.84 90 bottom
SJ13  17.98,32.84 90 bottom
SJ14  23.06,47.98 90 bottom
SJ15  20.52,47.98 90 bottom
SJ16  18.08,47.98 90 bottom
SJ17  23.16,63.42 90 bottom
SJ18  20.62,63.42 90 bottom
SJ19  18.08,63.42 90 bottom
SW3  97.91,42.14 90 top
U1  137.1,26.9 270 top  (outside the outline)
U3  88.66,29.82 90 top
U$1  24.31,9.06 180 top
U$2  -33.1,22.4 90 top  (outside the outline)
U$5  24.31,24.3 180 top
U$6  24.31,39.54 180 top
U$7  24.31,54.78 180 top
U$8  -33.1,29.2 90 top  (outside the outline)
U$13  -33.12,15.57 90 top  (outside the outline)
U$14  -33.12,8.75 90 top  (outside the outline)
X8  -16.89,43.31 270 top  (outside the outline)
X14  91.08,15.35 180 top

### Tracks (layer width: path | path; a pad name or v marks a point on that pad's centre or on a via)
1A1M  (2 unrouted)
1A2M  (1 unrouted)
1A3M  (1 unrouted)
1A$4M  (1 unrouted)
1B1M  (2 unrouted)
1B2M  (1 unrouted)
1B3M  (1 unrouted)
1B$4M  (1 unrouted)
2A1M  (2 unrouted)
2A2M  (1 unrouted)
2A3M  (1 unrouted)
2A$4M  (1 unrouted)
2B1M  (2 unrouted)
2B2M  (1 unrouted)
2B3M  (1 unrouted)
2B$4M  (1 unrouted)
3.3V  (via drill 0.4)  (28 unrouted)
  Top 0.2: IC1.42 78.44,21.16 v78.7,20.9 | v82.1,21.1 81.55,21.1 C10.2 | IC1.54 73.86,24.96 73.2,24.3 73.2,22.1 v73.4,21.9 | 72.36,11.74 72.36,10.06
  Top 0.254: IC1.96 59.74,15.16 C12.2 | IC1.84 60.76,21.16 60.54,20.93 60.54,20.17 C14.2 | IC1.71 65.36,29.25 65.93,29.82 65.93,30.99 65.75,31.17 | 65.75,31.17 C8.2 | IC1.54 73.86,29.18 74.38,29.7 74.38,31.06 C9.2 73,32.07 v72.41,31.48 72.53,31.6 | 83.24,30.21 C67.2 R2.2 R15.2 | 83.24,30.21 C1.2 R3.2 R1.2 | Q1.4 82.75,12.37 v82.44,12.68 | U3.4 86.5,29.45 85.74,30.21 83.24,30.21 | 65.75,31.17 65.75,31.43 v65.8,31.48 | 72.36,11.74 IC1.19 72.36,10.06 71.6,9.3 71.6,8.9 C11.2 70.93,8.73 70.6,8.4 70.6,7.4 70.3,7.1 69.7,7.1 R14.2
  Bottom 0.2: v72.41,31.48 v65.8,31.48 | v82.1,21.1 78.9,21.1 v78.7,20.9 78.5,21.1 76.2,21.1 76.1,21.8 73.5,21.8 v73.4,21.9
5V  (via drill 0.4)  (5 unrouted)
  Top 0.2: C64.1 61.76,10.24 v61.8,10.2
  Bottom 0.2: v61.8,10.2 61.8,7.75 EXP1.10
24V  (12 unrouted)
AGND  (5 unrouted)
  Top 0.254: IC1.11 68.36,12.56 68.6,12.8 70.1,12.8 70.36,12.54 IC1.15
AVCC  (4 unrouted)
  Top 0.254: IC1.12 68.86,10.36 68.7,10.2 68,10.2 67.86,10.34 IC1.10
BUZZER-RRD  (via drill 0.4)
  Top 0.2: IC1.20 72.86,13.34 v72.6,13.6
  Bottom 0.2: EXP1.1 52.5,4.31 52.5,3.5 53.1,2.9 55.8,2.9 56.6,3.7 56.6,8.2 54.7,10.1 54.7,13.1 55.6,14 61.6,14 62,13.6 66.7,13.6 67.2,13.1 70.3,13.1 70.8,13.6 v72.6,13.6
DIR1  (via drill 0.4)  (1 unrouted)
  Top 0.254: IC1.80 59.43,23.16 58.61,22.33 v58.61,22.15
  Bottom 0.2: 46.9,22.3 58.55,22.3 v58.61,22.15
DIR2  (via drill 0.4)  (1 unrouted)
  Top 0.2: 76.15,24.66 76.04,24.66 75.5,25.2 v75.5,25.3
  Top 0.203: IC1.49 76.15,24.66
  Bottom 0.2: 46.9,23.1 58.1,23.1 59.5,24.5 64.1,24.5 65,25.4 66.4,25.4 67,24.8 75,24.8 v75.5,25.3
DIR3  (via drill 0.4)  (1 unrouted)
  Top 0.2: IC1.58 71.86,28.04 v71.8,28.2
  Bottom 0.2: v71.8,28.2 71.8,27.9 70.3,26.4 67.8,26.4 67.2,27 65.3,27 65,27.3 63.6,27.3 63,27.9 60.8,27.9 59.8,26.9 58.3,26.9 56.9,25.5 46.9,25.5
DIR4  (via drill 0.4)  (1 unrouted)
  Top 0.2: IC1.56 72.86,28.04 v72.7,28.2 72.8,28.1
  Bottom 0.2: v72.7,28.2 70.5,26 67.6,26 67,26.6 65.1,26.6 64.8,26.9 63.4,26.9 62.8,27.5 61,27.5 60,26.5 58.5,26.5 57.1,25.1 46.9,25.1
EN1  (via drill 0.4)  (1 unrouted)
  Top 0.2: IC1.81 60.16,22.66 v59.6,22.1
  Bottom 0.2: v59.6,22.1 59,21.5 58.4,21.5 57.8,21.9 46.9,21.9
EN2  (via drill 0.4)  (1 unrouted)
  Top 0.2: IC1.48 75.64,24.16 v75.5,24.3
  Bottom 0.2: 46.9,22.7 58.3,22.7 59.7,24.1 64.3,24.1 65.2,25 66.2,25 66.8,24.4 75.4,24.4 v75.5,24.3
EN3  (via drill 0.4)  (1 unrouted)
  Top 0.2: IC1.59 71.36,25.44 v71.4,25.4
  Bottom 0.2: v71.4,25.4 71.2,25.2 67.2,25.2 66.6,25.8 64.7,25.8 64.4,26.1 63,26.1 62.4,26.7 61.4,26.7 60.4,25.7 58.9,25.7 57.5,24.3 46.9,24.3
EN4  (via drill 0.4)  (1 unrouted)
  Top 0.2: IC1.57 72.36,25.54 v72.5,25.4
  Bottom 0.2: v72.5,25.4 72.5,25.5 72,26 71.1,26 70.7,25.6 67.4,25.6 66.8,26.2 64.9,26.2 64.6,26.5 63.2,26.5 62.6,27.1 61.2,27.1 60.2,26.1 58.7,26.1 57.3,24.7 46.9,24.7
GND  (via drill 0.4)  (60 unrouted)
  Top 0.2: IC1.97 62.57,14.66 62.88,14.97 62.88,21.52 62.74,21.66 60.74,21.66 | IC1.41 76.04,20.66 75.7,21 v75.5,21 75.1,21 74.3,20.2 74.3,17.3 75.94,15.66 IC1.31 | IC1.55 73.36,25.06 72.7,24.4 72.7,21.7 v73.4,21 | v58.7,10.1 58.7,11.03 C64.2 | EXP1.9 62.7,4.31 62.7,3 61.8,2.1 42.8,2.1 42.28,2.62 EXP2.9 42.28,2.58 41.8,2.1 26.3,2.1 24.9,3.5 24.9,5 24,5.9 23.5,5.9 23,6.4 23,7.75 U$1.GND@0 | C10.1 80.57,19.27 v80.4,19.1 | 88.66,15.35 88.65,15.35
  Top 0.254: C67.1 84.94,28.98 86.25,27.67 | 86.25,27.67 86.67,27.25 U3.6 | X14.GND 89.83,15.35 88.66,15.35 87.9,16.11 87.9,17.59 C4.1 | IC1.83 60.74,21.66 60.33,21.66 C14.1 | IC1.72 C8.1 | IC1.55 C9.1 72.5,30.37 v72.41,30.46 | C5.1 v87.65,12.81 | 96.07,36.81 U3.GND2 95.95,36.68 | C1.1 84.94,32 v84.85,32.09 | 86.25,27.67 v86.25,27.29
  Top 0.406: U3.GND2 96.31,36.75 U3.CDNC2 U3.CDNC1 96.31,22.85 U3.GND1
  Bottom 0.2: v73.4,21 v75.5,21 75.7,21 76.04,20.66 76.6,20.66 78.16,19.1 v80.4,19.1 | EXP1.9 62.57,4.33 61.4,5.5 61.4,7.4 60.5,8.3 59.1,8.3 58.7,8.7 v58.7,10.1 | 87.6,15.1 87.6,12.85 v87.65,12.81
  other vias: 76.96,5.69
ISP_BOOT  (via drill 0.4)  (3 unrouted)
  Top 0.254: S2.2 S2.1
  other vias: 81.77,29.84
LED1  (1 unrouted)
LED2  (1 unrouted)
LED3  (1 unrouted)
LED4  (1 unrouted)
MOSI1  (via drill 0.4)
  Top 0.2: IC1.60 70.86,25.86 69.9,24.9 69.9,14.6 v69.5,14.2
  Bottom 0.2: EXP1.3 55.03,4.3 54.4,4.3 53.1,5.6 51.9,5.6 51,6.5 51,8 53.1,10.1 53.1,13.9 54.8,15.6 62.4,15.6 62.8,15.2 69,15.2 69.5,14.7 v69.5,14.2
N$1
  Top 0.254: IC1.22 73.86,10.34 74.5,9.7 74.5,7.7 74.1,7.3 73.42,7.3 Q2.2 73.55,7.17 C2.1
N$2
  Top 0.254: IC1.23 74.36,10.57 75.12,9.8 75.12,9.2 Q2.1 75.62,9 C3.1
N$3  (via drill 3.2 pad 6)  (3 unrouted)
  other vias: 3,3 97,3 97,70.5 3,70.5
N$4  (1 unrouted)
N$6
  Bottom 1.016: U$1.MS1 23.04,18.16 SJ8.2
N$8
  Bottom 1.016: U$1.MS2 20.5,18.13 SJ9.2
N$10
  Bottom 1.016: U$1.MS3 17.96,18.16 SJ10.2
N$12  (1 unrouted)
N$14  (3 unrouted)
N$15
  Bottom 1.016: U$5.MS1 23.04,33.62 SJ11.2
N$17
  Bottom 1.016: U$5.MS2 20.5,33.62 SJ12.2
N$19
  Bottom 1.016: U$5.MS3 17.96,33.62 SJ13.2
N$22  (1 unrouted)
N$23  (2 unrouted)
N$24  (3 unrouted)
N$25
  Bottom 1.016: U$6.MS1 23.04,48.77 SJ14.2
N$26
  Bottom 1.016: U$6.MS2 20.5,48.77 SJ15.2
N$27
  Bottom 1.016: U$6.MS3 17.96,48.87 SJ16.2
N$28  (2 unrouted)
N$29  (3 unrouted)
N$31  (1 unrouted)
N$32  (3 unrouted)
N$33
  Bottom 1.016: U$7.MS1 23.04,64.31 SJ17.2
N$34
  Bottom 1.016: U$7.MS2 20.5,64.31 SJ18.2
N$35  (1 unrouted)
N$36
  Bottom 1.016: U$7.MS3 17.96,64.31 SJ19.2
N$37  (2 unrouted)
N$51  (via drill 0.4)
  Top 0.254: R7.2 86.59,14.29 86.12,13.82 v85.87,13.82 | 83.39,13.38 Q1.5 83.39,13.82 | Q1.2 Q1.1 Q1.6 83.39,13.82 | 83.84,13.82 v84.09,13.82 83.39,13.82
  Bottom 0.2: v85.87,13.82 v84.09,13.82
N$55  (2 unrouted)
N$61
  Top 0.254: R8.1 87.88,10.78 91.08,13.97 X14.D+
N$62
  Top 0.254: R9.1 86.59,16.6 X14.D-
N$84  (1 unrouted)
N$85  (1 unrouted)
N$86  (1 unrouted)
N$87  (1 unrouted)
P1_30_CLICK-ON-RRD  (via drill 0.4)
  Top 0.2: v73.2,14.2 73.36,14.04 IC1.21
  Bottom 0.2: EXP1.2 52.5,6.85 53.4,6.8 54.5,5.6 55.7,5.6 56.2,6.1 56.2,8 54.3,9.9 54.3,13.3 55.4,14.4 61.8,14.4 62.2,14 66.9,14 67.4,13.5 70.1,13.5 70.8,14.2 v73.2,14.2
P2.6_FAN_FET  (via drill 0.4)
  Top 0.2: IC1.67 67.36,25.74 67.4,25.7 67.4,20.9 v67,20.4 | v57.2,19.8 57.2,23.38 IC2.9
  Top 0.254: 57.3,23.44 IC2.9
  Bottom 0.2: v67,20.4 66.1,20.4 65.8,20.7 62.8,20.7 61.8,19.6 57.4,19.6 v57.2,19.8
P2.6_FAN_FET_5V  (via drill 0.4)  (1 unrouted)
  Top 0.2: v52.8,20.5 55.3,20.5 56.01,21.21 IC2.10
  Bottom 0.2: v52.8,20.5 52.6,20.7 51.7,20.7 51.3,21.1 46.9,21.1
P2.7_HOTEND_FET  (via drill 0.4)
  Top 0.2: IC1.66 67.86,21.06 v68.1,20.8
  Top 0.254: v50.9,19.5 50.9,17.34 IC2.3
  Bottom 0.2: v68.1,20.8 68.1,20.5 67.3,19.7 66.2,19.7 65.6,20.3 63,20.3 62,19.2 51.2,19.2 v50.9,19.5
P2.7_HOTEND_FET_ISOLATED  (via drill 0.5)  (1 unrouted)
  Top 0.254: IC2.2 49.66,19.64 v49.5,19.9
  Bottom 0.2: v49.5,19.9 49.2,20.3 46.9,20.3
P2.9  (via drill 0.4)  (1 unrouted)
  Top 0.2: 68.86,25.75 68.86,25.66 68.7,25.5 68.7,19.7 v68.4,19.4
  Top 0.203: IC1.64 68.86,25.75
  Top 0.254: IC1.64
  Bottom 0.2: v68.4,19.4 68.6,19.2 74,19.2 74.9,18.3 74.9,17.4 76.5,15.8 76.5,15.1 76.9,14.7
PLAY  (2 unrouted)
PLAY_LED  (via drill 0.4)  (1 unrouted)
  Top 0.2: IC1.82 62.94,22.16 63.4,21.7 63.4,19.5 63.6,19.3 v63.6,19.1
  Bottom 0.2: v63.6,19.1 63.8,19.1 64.1,18.8 73.8,18.8 74.5,18.1 74.5,17.2 76.1,15.6 76.1,14.8 76.5,14.4
PWM0_PSU_OUT  (via drill 0.4)
  Top 0.2: IC1.69 66.36,25.64 66.6,25.4 66.6,22.3 v66.3,22 | v54.7,21.2 54.7,22.7 54.6,22.8 54.6,23.32 IC2.11
  Top 0.254: 54.7,23.42 IC2.11
  Bottom 0.2: v66.3,22 65.8,21.5 62.4,21.5 61.4,20.4 58.2,20.4 57.8,20.8 56.6,20.8 56.2,21.2 v54.7,21.2
PWM0_PSU_OUT_5V  (via drill 0.4)  (1 unrouted)
  Top 0.254: IC2.12 53.47,21.33 v53.6,21.2
  Bottom 0.2: v53.6,21.2 53.3,21.5 46.9,21.5
PWM1_BED_HEATER  (via drill 0.4)
  Top 0.2: IC1.68 66.86,25.74 67,25.6 67,21.7 v66.4,21.1
  Top 0.254: v53.6,19.8 53.6,18.9 53.5,18.8 53.5,17.34 IC2.5
  Bottom 0.2: v66.4,21.1 62.6,21.1 61.6,20 58,20 57.6,20.4 56.8,20.4 56.2,19.8 v53.6,19.8
PWM1_BED_HEATER_ISOLATED  (via drill 0.4)  (1 unrouted)
  Top 0.254: IC2.4 52.2,19.7 v51.9,20
  Bottom 0.2: v51.9,20 51.8,20 51.1,20.7 46.9,20.7
RESET  (2 unrouted)
  Top 0.254: IC1.17 71.36,9.96 71.1,9.7 70.5,9.7 70.1,9.3 70.1,8.85 R14.1
RX_0  (1 unrouted)
  Top 0.254: IC1.99 60.05,13.66
SCK1  (via drill 0.4)
  Top 0.2: IC1.62 69.86,25.46 69.5,25.1 69.5,15.1 v68.6,14.2 | EXP1.5 57.07,4.33 55.8,5.6 54.6,5.6 53.7,6.5 53.7,7.8 v53.2,8.3
  Bottom 0.2: v53.2,8.3 53.2,9.6 53.5,9.9 53.5,13.7 55,15.2 62.2,15.2 62.6,14.8 68.5,14.8 68.6,14.7 v68.6,14.2
SD-CD-ON-RRD  (via drill 0.4, 0.5)
  Top 0.2: IC1.25 75.36,11.84 75.4,11.88 75.4,12.5 v75.5,12.6 | v43,5.7 41.11,5.7 EXP2.7
  Bottom 0.2: v43,5.7 44.8,7.5 49.3,7.5 52.3,10.5 52.3,14.3 54.4,16.4 62.8,16.4 63.2,16 70.4,16 71.2,15.2 73.9,15.2 74.4,14.7 74.4,13.7 v75.5,12.6
SD-CS-ON-RRD  (via drill 0.4, 0.5)
  Top 0.2: v31.3,3 33.3,3 33.5,3.2 33.5,5.71 EXP2.4 | v74,13.2 74.86,12.34 IC1.24
  Bottom 0.2: v31.3,3 31.8,3 32.7,2.1 40.8,2.1 41.8,3.1 42.7,3.1 43.9,4.3 43.9,5.9 45.1,7.1 49.5,7.1 52.7,10.3 52.7,14.1 54.6,16 62.6,16 63,15.6 70.2,15.6 71,14.8 73.7,14.8 74,14.5 v74,13.2
SD_CD/KILL-ON-RRD  (via drill 0.4)  (1 unrouted)
  Top 0.2: SJ1.2 39.8,6.93 EXP2.8 | v38.8,9.4 38.8,10.99 SJ1.3 | v73.5,18.1 73.9,18.5 73.9,20.4 74.1,20.6 74.1,22.2 73.6,22.7 73.6,24.1 74.86,25.36 IC1.52
  Bottom 0.2: v73.5,18.1 73.2,18.4 53.4,18.4 50.3,15.3 50.3,11.5 48.3,9.5 39,9.5 38.9,9.4 v38.8,9.4
SD_CS  (via drill 0.4)  (1 unrouted)
  Top 0.2: IC1.79 62.94,23.66 63.1,23.5 63.6,23.5 v63.8,23.3
  Top 0.203: v86.12,34.02 86.19,34.08
  Top 0.254: U3.2 86.97,31.65 86.5,32.11 86.5,33.76 86.19,34.08 84.98,35.29 R1.1
  Bottom 0.2: v63.8,23.3 64.1,23.3 64.4,23.6 74.5,23.6 74.8,23.3 78,23.3
SD_IRQ-ENC-A-ON-RRD  (via drill 0.4)
  Top 0.2: IC1.27 76.04,13.66 v75.5,14.2
  Bottom 0.2: EXP2.5 37.2,5.5 37.5,5.8 37.7,5.8 38.2,6.3 38.2,7.9 39,8.7 40.3,8.7 40.7,9.1 48.5,9.1 50.7,11.3 50.7,15.1 53.6,18 72.6,18 73.2,17.4 73.7,17.4 75.5,15.5 v75.5,14.2
SD_MISO  (via drill 0.4)  (1 unrouted)
  Top 0.2: v64.7,17 64.7,19.7 65.3,20.2 65.3,22.8 v65.1,23 65.1,24.1 64.8,24.4 63.5,24.4 63.24,24.66 IC1.77
  Top 0.203: v85.11,25.76 85.72,26.38
  Top 0.254: U3.7 85.95,26.15 85.72,26.38 R2.1
  Bottom 0.2: 85.1,25.5 v85.11,25.76 | v64.7,17 64.1,16.4 63.4,16.4 63,16.8 54.2,16.8 51.9,14.5 51.9,10.7 49.1,7.9 41.7,7.9 41.2,7.4 41.2,3.2 40.5,2.5 33.95,2.5 EXP2.1 | v65.1,23 65.3,23.2 74.3,23.2 74.6,22.9 78,22.9
SD_MOSI  (via drill 0.4)  (1 unrouted)
  Top 0.2: v65.4,19.4 65.7,19.7 65.7,24.1 | IC1.76 63.34,25.16 63.7,24.8 65,24.8 65.7,24.1 | 65.7,24.1 v65.7,24.3
  Top 0.203: v89.04,35.29 89.3,35.03 89.3,30.71 89.17,30.59 87.65,30.59 U3.3
  Top 0.254: U3.3 86.54,30.55 86,31.09 86,32.37 85.11,33.25 R3.1
  Bottom 0.2: v65.4,19.4 65,19.9 63.2,19.9 62.2,18.8 53.2,18.8 49.9,15.5 49.9,11.7 48.1,9.9 39.3,9.9 39.1,10.1 38.4,10.1 38.1,9.8 38.1,8.4 37.2,7.5 EXP2.6 | v65.7,24.3 66,24 74.7,24 75,23.7 78,23.7
SD_SCK  (via drill 0.4)  (1 unrouted)
  Top 0.2: v63.8,17 63.8,18.1 64.3,18.6 64.3,19.5 63.8,20 63.8,21.5 v64.5,22.2 64.5,23.8 64.3,24 63.3,24 63.14,24.16 IC1.78
  Top 0.203: 87.74,28.55 U3.5 86.58,28.35 v86.38,28.55
  Bottom 0.2: v63.8,17 63.4,17 63.2,17.2 54,17.2 51.5,14.7 51.5,10.9 48.9,8.3 41.4,8.3 40.8,7.7 40.8,3.4 40.3,2.9 34.1,2.9 33.5,3.5 33.5,5.49 EXP2.2 | v64.5,22.2 65.4,22.2 66,22.8 74.1,22.8 74.4,22.5 78,22.5
SD_WP-ENC-B-ON-RRD  (via drill 0.4)
  Top 0.2: v74.9,15.1 74.9,13.7 75.3,13.3 75.9,13.3 76.04,13.16 IC1.26
  Bottom 0.2: EXP2.3 34.7,4.29 34.7,3.6 35,3.3 37.7,3.3 38.2,3.8 38.2,5.6 38.6,6 38.6,7.7 39.2,8.3 40.5,8.3 40.9,8.7 48.7,8.7 51.1,11.1 51.1,14.9 53.8,17.6 72.4,17.6 73.1,16.9 73.5,16.9 74.9,15.5 v74.9,15.1
SSEL1  (via drill 0.4)
  Top 0.2: IC1.63 69.36,25.56 69.1,25.3 69.1,15.6 v67.7,14.2
  Bottom 0.2: v67.7,14.2 67.5,14.4 62.4,14.4 62,14.8 55.2,14.8 53.9,13.5 53.9,8.03 EXP1.4
STP1  (via drill 0.4)  (1 unrouted)
  Top 0.2: IC1.75 63.36,25.96 63,25.6 62.32,25.6 v61.87,26.05
  Bottom 0.2: v61.87,26.05 61.87,25.47 61.7,25.3 59.1,25.3 57.7,23.9 46.9,23.9
STP2  (via drill 0.4)  (1 unrouted)
  Top 0.203: IC1.74 63.86,25.61 v64.07,25.4
  Bottom 0.2: v64.07,25.4 64.07,25.37 63.6,24.9 59.3,24.9 57.9,23.5 46.9,23.5
STP3  (via drill 0.4)  (1 unrouted)
  Top 0.2: IC1.73 64.36,28.14 v64.2,28.3
  Bottom 0.2: 46.9,26.3 56.5,26.3 57.9,27.7 59.4,27.7 60.4,28.7 63.4,28.7 63.8,28.3 v64.2,28.3
STP4  (via drill 0.4)  (1 unrouted)
  Top 0.2: IC1.70 65.86,28.16 v66,28.3
  Bottom 0.2: v66,28.3 65.7,28.3 65.1,27.7 63.8,27.7 63.2,28.3 60.6,28.3 59.6,27.3 58.1,27.3 56.7,25.9 46.9,25.9
TH1_HOTEND  (3 unrouted)
  Top 0.203: 67.33,11.41 IC1.9
TH2_BED  (3 unrouted)
  Top 0.203: 66.82,11.41 IC1.8
TX_0  (1 unrouted)
  Top 0.254: IC1.98 59.84,14.16
USB_N
  Top 0.254: IC1.30 78.56,15.16 arc45 79.1,15.38 79.43,15.71 arc-45 80.33,16.08 83.71,16.08 arc45 84.38,16.36 R9.2 C4.2
USB_P
  Top 0.254: IC1.29 78.5,14.66 arc45 79.4,15.03 79.62,15.25 arc-45 80.52,15.63 83.71,15.63 arc-45 84.38,15.35 R7.1 C5.2 R8.2
VUSB  (1 unrouted)
X_MAX
  Top 0.2: IC1.39 79.26,19.66 80.2,20.6 80.2,26.2 76.96,29.44 76.96,29.93
  Top 0.203: 76.96,32.17 76.96,29.93 | IC1.39
X_MIN  (via drill 0.4)
  Top 0.2: 77.38,30.23 77.38,29.62 80.6,26.4 80.6,20.4 79.36,19.16 IC1.38 75.54,19.16 v75.5,19.2 | v71.1,13 70.3,13.8 70.3,20.1 v70.6,20.4
  Top 0.203: 77.38,32.14 77.38,30.23
  Bottom 0.2: v71.1,13 70.8,12.7 67,12.7 66.5,13.2 61.8,13.2 61.4,13.6 55.8,13.6 55.1,12.9 55.1,10.3 57.4,8 58.2,8 58.6,7.6 58.6,3.7 56.6,1.7 23.3,1.7 22.9,1.3 16.06,1.3 FFC1.5 | v70.6,20.4 71,20.4 71.7,19.6 75.1,19.6 v75.5,19.2
Y_MAX
  Top 0.2: IC1.43 78.66,21.66 79.4,22.4 79.4,25.8 76.12,29.07 76.12,29.56
  Top 0.203: 76.12,32.15 76.12,29.56
Y_MIN  (via drill 0.4)
  Top 0.2: 77.11,20.17 79.17,20.17 79.8,20.8 79.8,26 76.54,29.26 76.54,29.72 | IC1.40 75.54,20.16 v75.5,20.1 | v72,13 72,13.2 70.7,14.5 70.7,19.5 71.1,19.9 71.7,19.9 v72.2,20.4
  Top 0.203: 76.54,32.16 76.54,29.72 | 77.11,20.17 IC1.40
  Bottom 0.2: v72,13 71.3,12.3 66.8,12.3 66.3,12.8 61.6,12.8 61.2,13.2 56,13.2 55.5,12.7 55.5,10.5 57.6,8.4 58.4,8.4 59,7.8 59,3.5 56.8,1.3 23.5,1.3 23.1,0.9 14.4,0.9 13.6,1.7 13.6,4.28 FFC1.4 | v72.2,20.4 72.2,20.2 72.4,20 75.4,20 v75.5,20.1
Z_MAX
  Top 0.2: IC1.45 78.46,22.66 78.6,22.8 78.6,25.4 75.3,28.7 75.3,29.14
  Top 0.203: 75.3,32.13 75.3,29.14
Z_MIN
  Top 0.2: IC1.44 78.56,22.16 79,22.6 79,25.6 78.8,25.8 78.3,26.3 75.72,28.88 75.72,29.31
  Top 0.203: 75.72,32.17 75.72,29.31